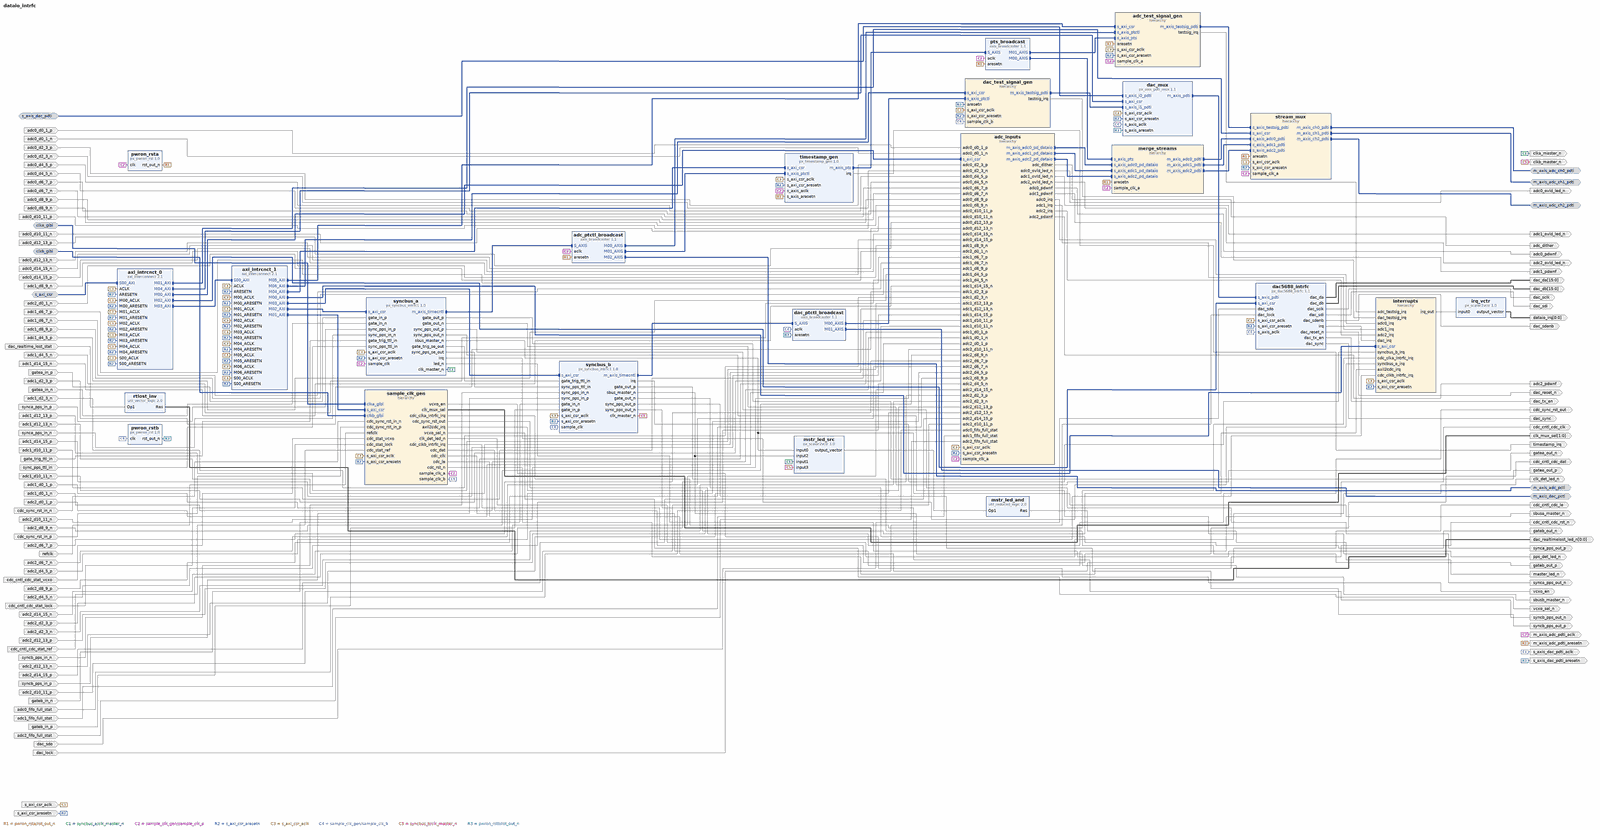
[diagram p0: block diagram of the top level, whole]
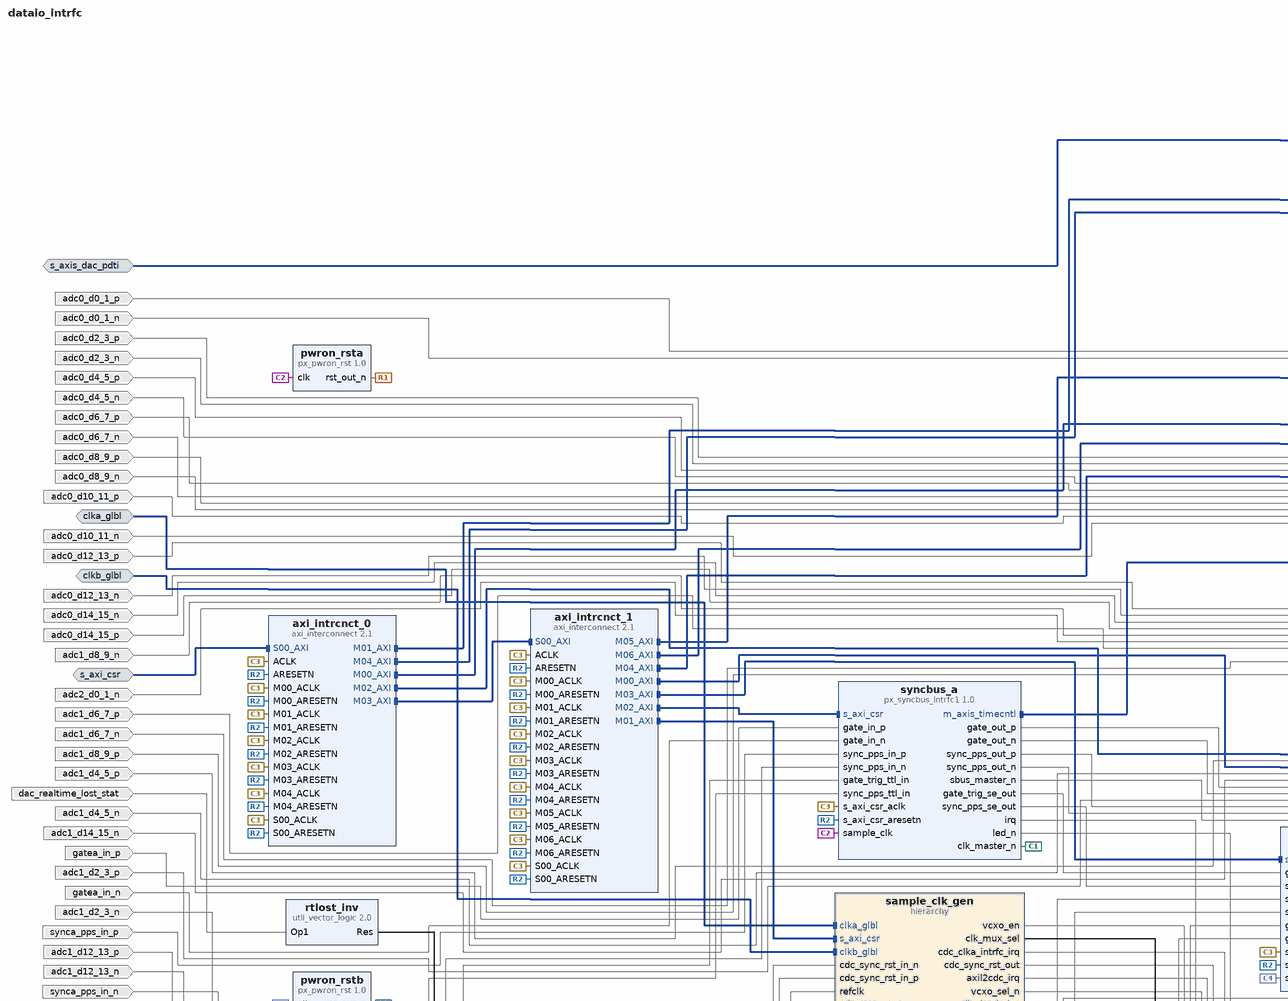
[diagram p1: block diagram of the top level, upper left part]
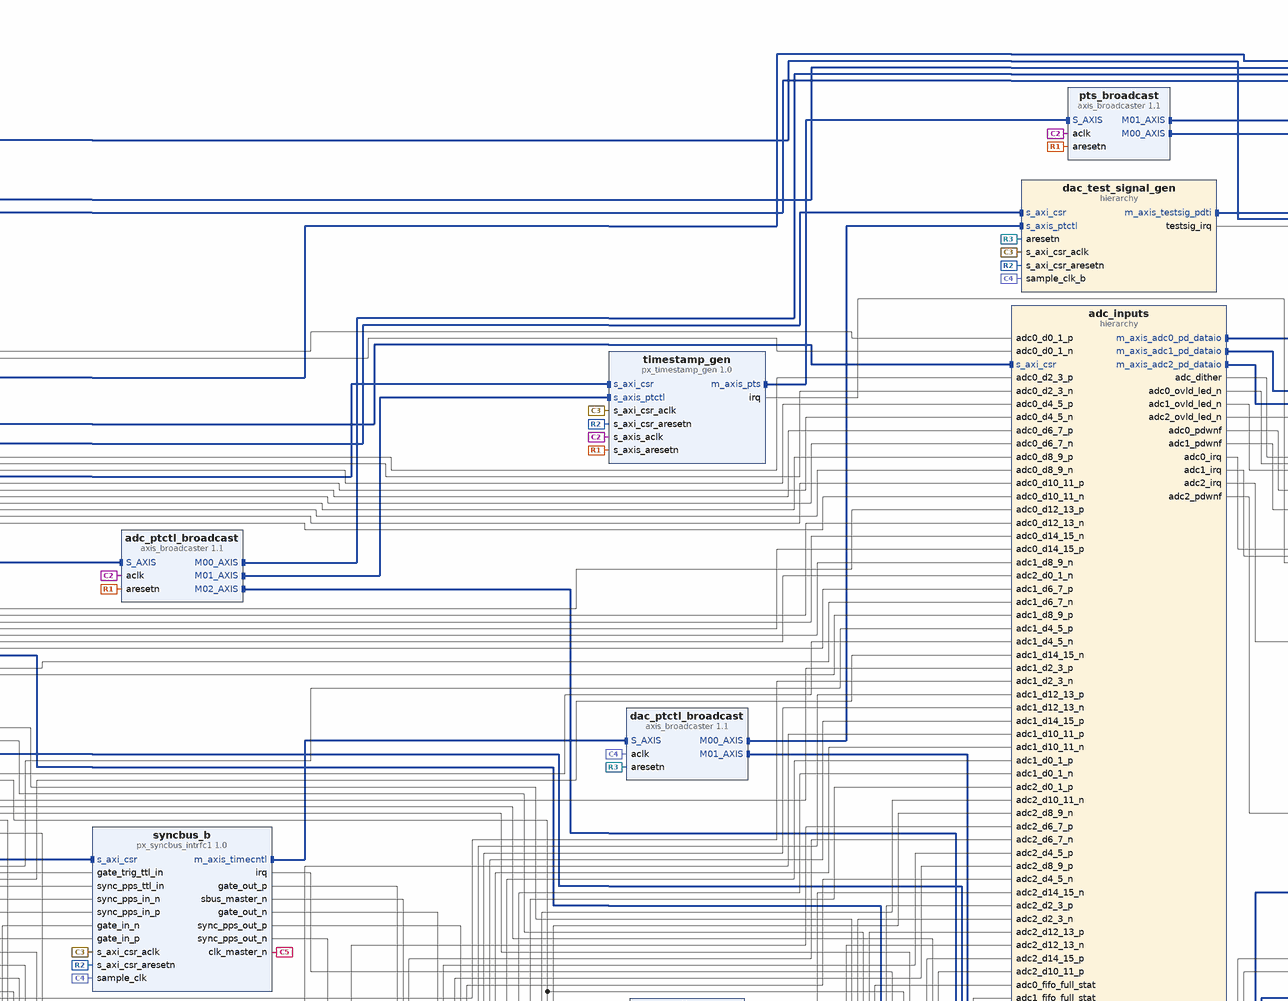
[diagram p2: block diagram of the top level, upper centre part]
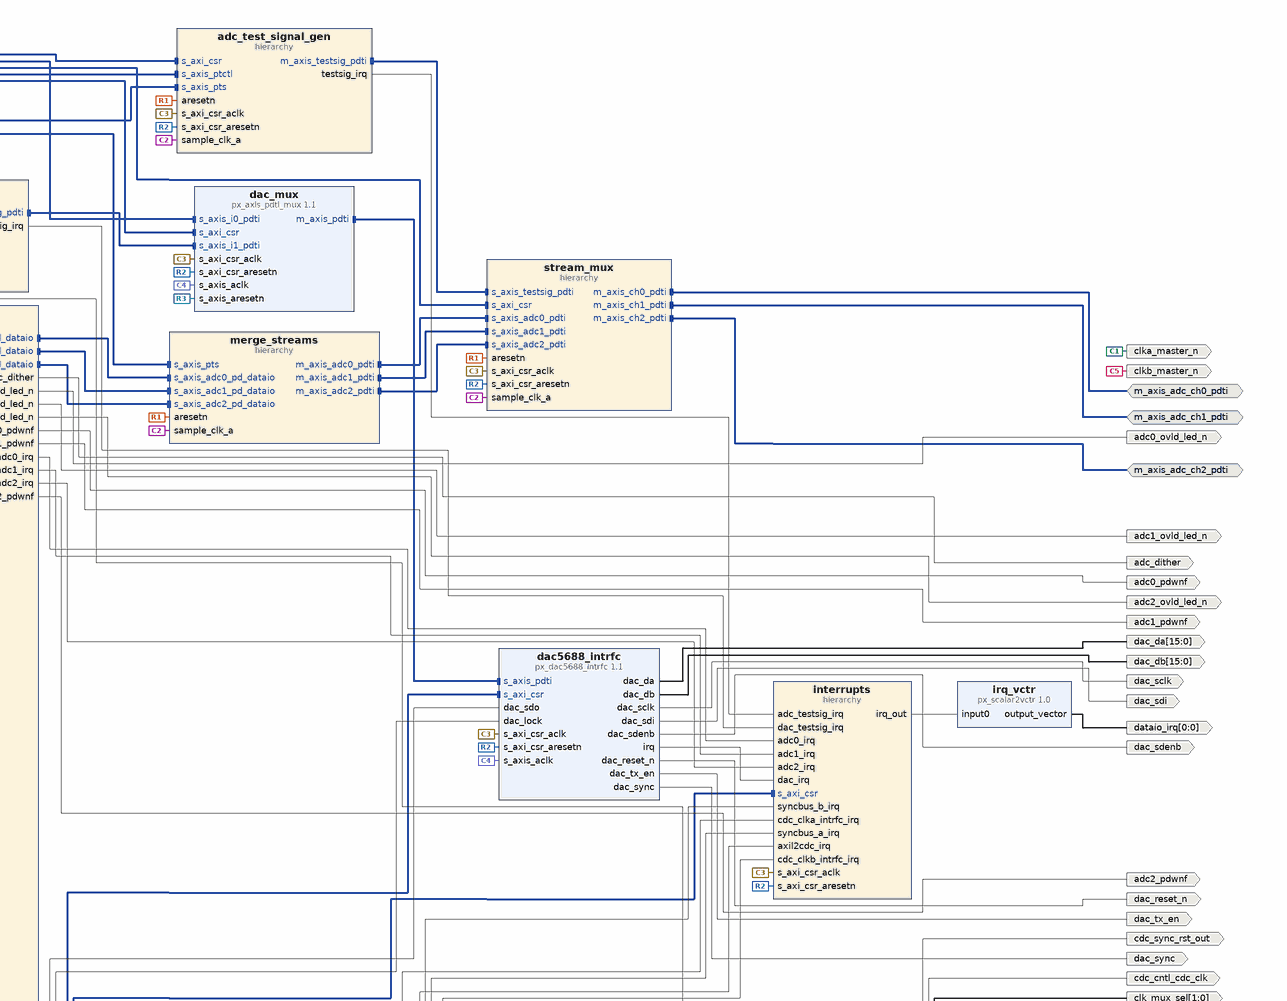
[diagram p3: block diagram of the top level, upper right part]
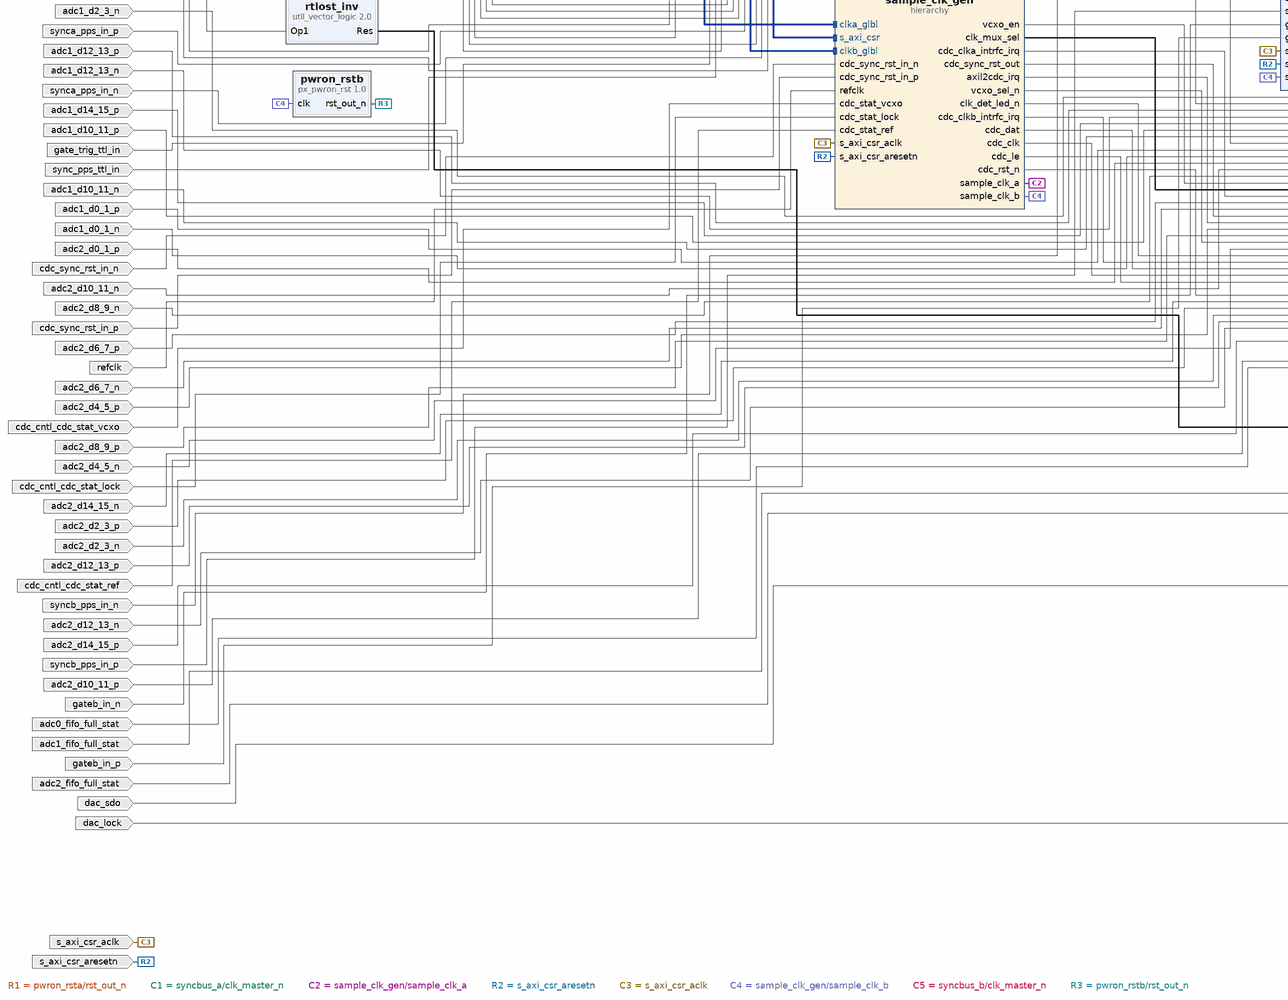
[diagram p4: block diagram of the top level, lower left part]
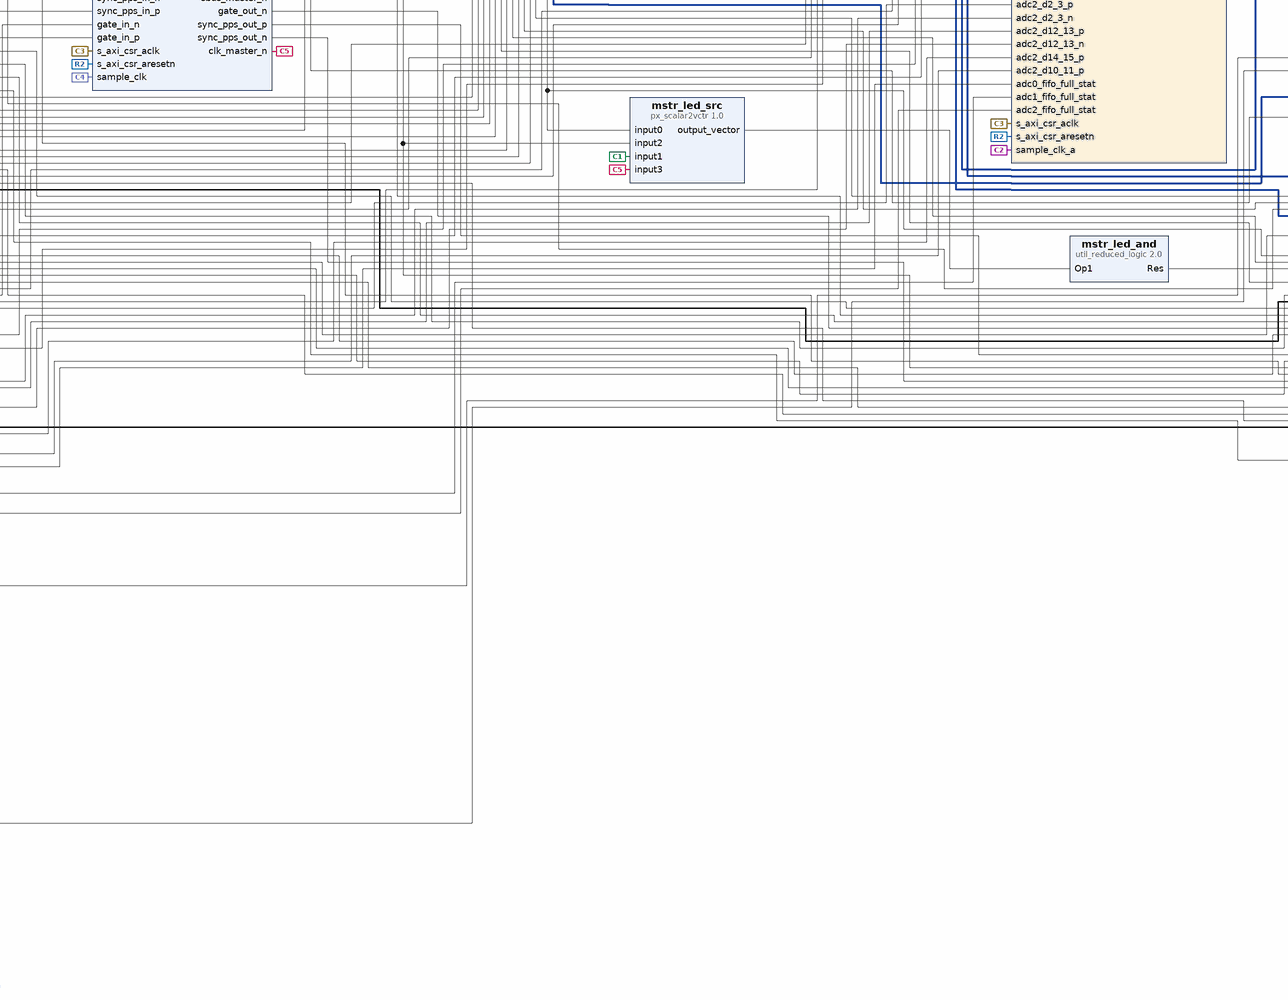
[diagram p5: block diagram of the top level, lower centre part]
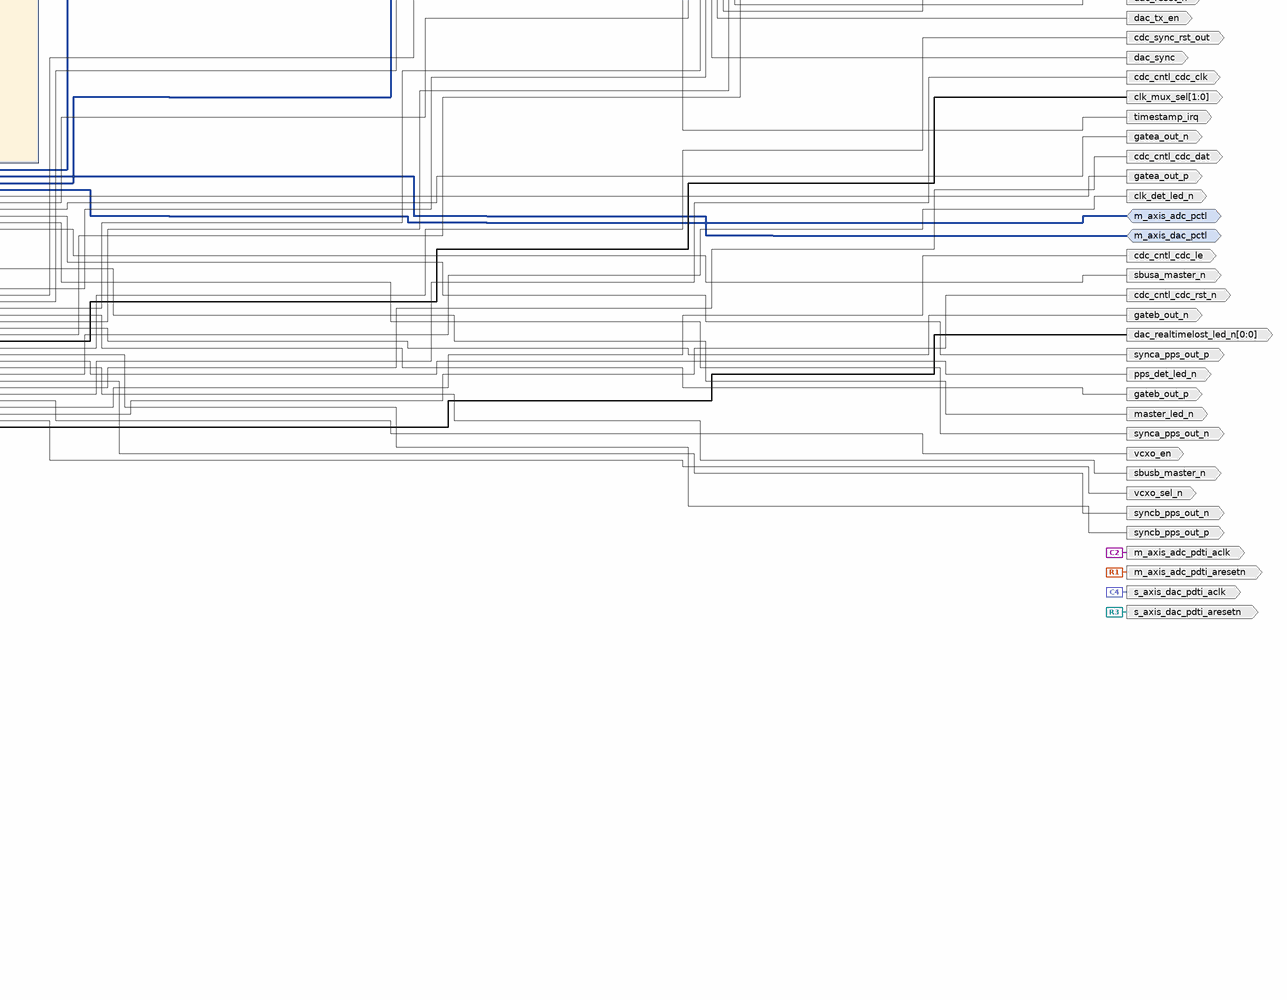
[diagram p6: block diagram of the top level, lower right part]
# Vivado block design dataio_intrfc, xcku060-ffva1156-2-e, Vivado 2017.2
create_bd_design dataio_intrfc

create_bd_intf_port -mode Master -vlnv xilinx.com:interface:axis_rtl:1.0 m_axis_adc_ch0_pdti
create_bd_intf_port -mode Master -vlnv xilinx.com:interface:axis_rtl:1.0 m_axis_adc_ch1_pdti
create_bd_intf_port -mode Master -vlnv xilinx.com:interface:axis_rtl:1.0 m_axis_adc_ch2_pdti
create_bd_intf_port -mode Slave -vlnv xilinx.com:interface:aximm_rtl:1.0 s_axi_csr
set_property -dict [list \
  CONFIG.DATA_WIDTH 32 \
  CONFIG.PROTOCOL AXI4LITE \
  CONFIG.ID_WIDTH 0 \
  CONFIG.ADDR_WIDTH 26 \
  CONFIG.AWUSER_WIDTH 0 \
  CONFIG.ARUSER_WIDTH 0 \
  CONFIG.WUSER_WIDTH 0 \
  CONFIG.RUSER_WIDTH 0 \
  CONFIG.BUSER_WIDTH 0 \
  CONFIG.READ_WRITE_MODE READ_WRITE \
  CONFIG.HAS_BURST 1 \
  CONFIG.HAS_LOCK 1 \
  CONFIG.HAS_PROT 1 \
  CONFIG.HAS_CACHE 1 \
  CONFIG.HAS_QOS 1 \
  CONFIG.HAS_REGION 1 \
  CONFIG.HAS_WSTRB 1 \
  CONFIG.HAS_BRESP 1 \
  CONFIG.HAS_RRESP 1 \
  CONFIG.SUPPORTS_NARROW_BURST 0 \
  CONFIG.NUM_READ_OUTSTANDING 1 \
  CONFIG.NUM_WRITE_OUTSTANDING 1 \
  CONFIG.MAX_BURST_LENGTH 1 \
  CONFIG.NUM_READ_THREADS 1 \
  CONFIG.NUM_WRITE_THREADS 1 \
  CONFIG.RUSER_BITS_PER_BYTE 0 \
  CONFIG.WUSER_BITS_PER_BYTE 0 \
] [get_bd_intf_ports s_axi_csr]
create_bd_intf_port -mode Slave -vlnv xilinx.com:interface:axis_rtl:1.0 s_axis_dac_pdti
set_property -dict [list \
  CONFIG.TDATA_NUM_BYTES 4 \
  CONFIG.TDEST_WIDTH 0 \
  CONFIG.TID_WIDTH 0 \
  CONFIG.TUSER_WIDTH 128 \
  CONFIG.HAS_TREADY 0 \
  CONFIG.HAS_TSTRB 0 \
  CONFIG.HAS_TKEEP 0 \
  CONFIG.HAS_TLAST 0 \
  CONFIG.LAYERED_METADATA undef \
] [get_bd_intf_ports s_axis_dac_pdti]
create_bd_intf_port -mode Master -vlnv xilinx.com:interface:axis_rtl:1.0 m_axis_dac_pctl
create_bd_intf_port -mode Slave -vlnv xilinx.com:interface:diff_clock_rtl:1.0 clka_glbl
set_property -dict {CONFIG.FREQ_HZ 200000000} [get_bd_intf_ports clka_glbl]
create_bd_intf_port -mode Slave -vlnv xilinx.com:interface:diff_clock_rtl:1.0 clkb_glbl
set_property -dict {CONFIG.FREQ_HZ 250000000} [get_bd_intf_ports clkb_glbl]
create_bd_intf_port -mode Master -vlnv xilinx.com:interface:axis_rtl:1.0 m_axis_adc_pctl
create_bd_port -dir I adc0_d0_1_p
create_bd_port -dir I adc0_d0_1_n
create_bd_port -dir I adc0_d2_3_p
create_bd_port -dir I adc0_d2_3_n
create_bd_port -dir I adc0_d4_5_p
create_bd_port -dir I adc0_d4_5_n
create_bd_port -dir I adc0_d6_7_p
create_bd_port -dir I adc0_d6_7_n
create_bd_port -dir I adc0_d8_9_p
create_bd_port -dir I adc0_d8_9_n
create_bd_port -dir I adc0_d10_11_p
create_bd_port -dir I adc0_d10_11_n
create_bd_port -dir I adc0_d12_13_p
create_bd_port -dir I adc0_d12_13_n
create_bd_port -dir I adc0_d14_15_n
create_bd_port -dir I adc0_d14_15_p
create_bd_port -dir I adc1_d8_9_n
create_bd_port -dir I adc2_d0_1_n
create_bd_port -dir I adc1_d6_7_p
create_bd_port -dir I adc1_d6_7_n
create_bd_port -dir I adc1_d8_9_p
create_bd_port -dir I adc1_d4_5_p
create_bd_port -dir I adc1_d4_5_n
create_bd_port -dir I adc1_d14_15_n
create_bd_port -dir I adc1_d2_3_p
create_bd_port -dir I adc1_d2_3_n
create_bd_port -dir I adc1_d12_13_p
create_bd_port -dir I adc1_d12_13_n
create_bd_port -dir I adc1_d14_15_p
create_bd_port -dir I adc1_d10_11_p
create_bd_port -dir I adc1_d10_11_n
create_bd_port -dir I adc1_d0_1_p
create_bd_port -dir I adc1_d0_1_n
create_bd_port -dir I adc2_d0_1_p
create_bd_port -dir I adc2_d10_11_n
create_bd_port -dir I adc2_d8_9_n
create_bd_port -dir I adc2_d6_7_p
create_bd_port -dir I adc2_d6_7_n
create_bd_port -dir I adc2_d4_5_p
create_bd_port -dir I adc2_d8_9_p
create_bd_port -dir I adc2_d4_5_n
create_bd_port -dir I adc2_d14_15_n
create_bd_port -dir I adc2_d2_3_p
create_bd_port -dir I adc2_d2_3_n
create_bd_port -dir I adc2_d12_13_p
create_bd_port -dir I adc2_d12_13_n
create_bd_port -dir I adc2_d14_15_p
create_bd_port -dir I adc2_d10_11_p
create_bd_port -dir O -type rst m_axis_adc_pdti_aresetn
create_bd_port -dir I gatea_in_p
create_bd_port -dir I gatea_in_n
create_bd_port -dir I synca_pps_in_p
create_bd_port -dir I synca_pps_in_n
create_bd_port -dir I gate_trig_ttl_in
create_bd_port -dir I sync_pps_ttl_in
create_bd_port -dir O gatea_out_p
create_bd_port -dir O gatea_out_n
create_bd_port -dir O synca_pps_out_p
create_bd_port -dir O synca_pps_out_n
create_bd_port -dir O sbusa_master_n
create_bd_port -dir O clka_master_n
create_bd_port -dir O pps_det_led_n
create_bd_port -dir O vcxo_en
create_bd_port -dir O vcxo_sel_n
create_bd_port -dir O -from 1 -to 0 clk_mux_sel
create_bd_port -dir O cdc_sync_rst_out
create_bd_port -dir O clk_det_led_n
create_bd_port -dir I cdc_sync_rst_in_n
create_bd_port -dir I cdc_sync_rst_in_p
create_bd_port -dir O -type clk m_axis_adc_pdti_aclk
set_property -dict [list \
  CONFIG.ASSOCIATED_BUSIF m_axis_adc_ch1_pdti:m_axis_adc_ch0_pdti:m_axis_adc_ch2_pdti:m_axis_adc_pctl \
  CONFIG.ASSOCIATED_RESET m_axis_adc_pdti_aresetn \
] [get_bd_ports m_axis_adc_pdti_aclk]
create_bd_port -dir I adc0_fifo_full_stat
create_bd_port -dir I adc1_fifo_full_stat
create_bd_port -dir I adc2_fifo_full_stat
create_bd_port -dir I dac_realtime_lost_stat
create_bd_port -dir O adc_dither
create_bd_port -dir O adc0_ovld_led_n
create_bd_port -dir O adc1_ovld_led_n
create_bd_port -dir O adc2_ovld_led_n
create_bd_port -dir O adc0_pdwnf
create_bd_port -dir O adc1_pdwnf
create_bd_port -dir O adc2_pdwnf
create_bd_port -dir I -type rst s_axi_csr_aresetn
create_bd_port -dir I -type clk s_axi_csr_aclk
set_property -dict {CONFIG.FREQ_HZ 250000000 CONFIG.ASSOCIATED_RESET s_axi_csr_aresetn} [get_bd_ports s_axi_csr_aclk]
create_bd_port -dir O master_led_n
create_bd_port -dir O -type intr timestamp_irq
create_bd_port -dir I -type clk refclk
set_property -dict {CONFIG.FREQ_HZ 200000000} [get_bd_ports refclk]
create_bd_port -dir O -from 0 -to 0 -type intr dataio_irq
create_bd_port -dir O -from 15 -to 0 dac_da
create_bd_port -dir O -from 15 -to 0 dac_db
create_bd_port -dir O dac_sclk
create_bd_port -dir O dac_sdi
create_bd_port -dir O dac_sdenb
create_bd_port -dir O dac_tx_en
create_bd_port -dir O dac_sync
create_bd_port -dir O dac_reset_n
create_bd_port -dir I dac_sdo
create_bd_port -dir I dac_lock
create_bd_port -dir O -from 0 -to 0 dac_realtimelost_led_n
create_bd_port -dir O -type clk s_axis_dac_pdti_aclk
set_property -dict [list \
  CONFIG.ASSOCIATED_BUSIF s_axis_dac_pdti:m_axis_dac_pctl \
  CONFIG.ASSOCIATED_RESET s_axis_dac_pdti_aresetn \
] [get_bd_ports s_axis_dac_pdti_aclk]
create_bd_port -dir I syncb_pps_in_n
create_bd_port -dir I syncb_pps_in_p
create_bd_port -dir I gateb_in_n
create_bd_port -dir I gateb_in_p
create_bd_port -dir O gateb_out_p
create_bd_port -dir O gateb_out_n
create_bd_port -dir O syncb_pps_out_p
create_bd_port -dir O syncb_pps_out_n
create_bd_port -dir O sbusb_master_n
create_bd_port -dir O clkb_master_n
create_bd_port -dir O -type rst s_axis_dac_pdti_aresetn
create_bd_port -dir I cdc_cntl_cdc_stat_vcxo
create_bd_port -dir I cdc_cntl_cdc_stat_lock
create_bd_port -dir I cdc_cntl_cdc_stat_ref
create_bd_port -dir O cdc_cntl_cdc_dat
create_bd_port -dir O -type clk cdc_cntl_cdc_clk
create_bd_port -dir O cdc_cntl_cdc_le
create_bd_port -dir O -type rst cdc_cntl_cdc_rst_n

create_bd_cell -type hier adc_inputs
create_bd_cell -type hier merge_streams
create_bd_cell -type hier stream_mux
create_bd_cell -type hier adc_test_signal_gen
create_bd_cell -type hier sample_clk_gen
create_bd_cell -type hier interrupts
create_bd_cell -type hier dac_test_signal_gen
create_bd_cell -type ip -vlnv xilinx.com:ip:util_reduced_logic:2.0 mstr_led_and
set_property -dict {CONFIG.C_SIZE 4} [get_bd_cells mstr_led_and]
create_bd_cell -type ip -vlnv xilinx.com:ip:axis_broadcaster:1.1 dac_ptctl_broadcast
create_bd_cell -type ip -vlnv xilinx.com:ip:axi_interconnect:2.1 axi_intrcnct_0
set_property -dict [list \
  CONFIG.NUM_SI 1 \
  CONFIG.NUM_MI 5 \
  CONFIG.M00_HAS_REGSLICE 1 \
  CONFIG.M01_HAS_REGSLICE 1 \
  CONFIG.M02_HAS_REGSLICE 1 \
  CONFIG.M03_HAS_REGSLICE 1 \
  CONFIG.M04_HAS_REGSLICE 1 \
  CONFIG.M05_HAS_REGSLICE 1 \
  CONFIG.M06_HAS_REGSLICE 1 \
  CONFIG.M07_HAS_REGSLICE 1 \
  CONFIG.S00_HAS_REGSLICE 1 \
] [get_bd_cells axi_intrcnct_0]
create_bd_cell -type ip -vlnv xilinx.com:ip:axi_interconnect:2.1 axi_intrcnct_1
set_property -dict [list \
  CONFIG.NUM_SI 1 \
  CONFIG.NUM_MI 7 \
  CONFIG.M00_HAS_REGSLICE 3 \
  CONFIG.M01_HAS_REGSLICE 3 \
  CONFIG.M02_HAS_REGSLICE 3 \
  CONFIG.M03_HAS_REGSLICE 3 \
  CONFIG.M04_HAS_REGSLICE 3 \
  CONFIG.M05_HAS_REGSLICE 3 \
  CONFIG.M06_HAS_REGSLICE 3 \
  CONFIG.M07_HAS_REGSLICE 1 \
  CONFIG.S00_HAS_REGSLICE 1 \
] [get_bd_cells axi_intrcnct_1]
create_bd_cell -type ip -vlnv xilinx.com:ip:axis_broadcaster:1.1 pts_broadcast
set_property -dict [list \
  CONFIG.M00_TDATA_REMAP {tdata[63:0]} \
  CONFIG.M01_TDATA_REMAP {tdata[63:0]} \
  CONFIG.M00_TUSER_REMAP {tuser[23:0]} \
  CONFIG.M01_TUSER_REMAP {tuser[23:0]} \
] [get_bd_cells pts_broadcast]
create_bd_cell -type ip -vlnv xilinx.com:ip:axis_broadcaster:1.1 adc_ptctl_broadcast
set_property -dict {CONFIG.NUM_MI 3 CONFIG.M02_TDATA_REMAP {tdata[7:0]}} [get_bd_cells adc_ptctl_broadcast]
create_bd_cell -type ip -vlnv pentek.com:px_ip:px_pwron_rst:1.0 pwron_rstb
set_property -dict {CONFIG.rst_clk_cycles 32 CONFIG.has_rst_input false CONFIG.has_rst_output false} [get_bd_cells pwron_rstb]
create_bd_cell -type ip -vlnv pentek.com:px_ip:px_axis_pdti_mux:1.1 dac_mux
set_property -dict {CONFIG.data_byte_width 4} [get_bd_cells dac_mux]
create_bd_cell -type ip -vlnv pentek.com:px_ip:px_dac5688_intrfc:1.1 dac5688_intrfc
set_property -dict {CONFIG.initial_tap_delay 175} [get_bd_cells dac5688_intrfc]
create_bd_cell -type ip -vlnv pentek.com:px_ip:px_pwron_rst:1.0 pwron_rsta
set_property -dict {CONFIG.rst_clk_cycles 32 CONFIG.has_rst_input false CONFIG.has_rst_output false} [get_bd_cells pwron_rsta]
create_bd_cell -type ip -vlnv pentek.com:px_ip:px_scalar2vctr:1.0 mstr_led_src
set_property -dict {CONFIG.number_inputs 4} [get_bd_cells mstr_led_src]
create_bd_cell -type ip -vlnv pentek.com:px_ip:px_scalar2vctr:1.0 irq_vctr
set_property -dict {CONFIG.number_inputs 1} [get_bd_cells irq_vctr]
create_bd_cell -type ip -vlnv pentek.com:px_ip:px_timestamp_gen:1.0 timestamp_gen
set_property -dict {CONFIG.pts_signal_width 1 CONFIG.has_des_ctl false} [get_bd_cells timestamp_gen]
create_bd_cell -type ip -vlnv pentek.com:px_ip:px_syncbus_intrfc1:1.0 syncbus_b
set_property -dict [list \
  CONFIG.is_single_ended_sig_master false \
  CONFIG.has_ssmc_gate_input false \
  CONFIG.has_user_pps_input false \
  CONFIG.ibuf_low_pwr true \
  CONFIG.initial_led_src 0 \
  CONFIG.has_user_sync_drive_in false \
  CONFIG.has_user_gate_drive_in false \
] [get_bd_cells syncbus_b]
create_bd_cell -type ip -vlnv xilinx.com:ip:util_vector_logic:2.0 rtlost_inv
set_property -dict {CONFIG.C_SIZE 1 CONFIG.C_OPERATION not} [get_bd_cells rtlost_inv]
create_bd_cell -type ip -vlnv pentek.com:px_ip:px_syncbus_intrfc1:1.0 syncbus_a
set_property -dict [list \
  CONFIG.has_ssmc_gate_input false \
  CONFIG.has_user_pps_input false \
  CONFIG.ibuf_low_pwr true \
  CONFIG.initial_led_src 0 \
  CONFIG.has_user_sync_drive_in false \
  CONFIG.has_user_gate_drive_in false \
  CONFIG.has_gate_trig_se_out true \
  CONFIG.has_sync_pps_se_out true \
] [get_bd_cells syncbus_a]

# ---- hierarchy /adc_inputs ----
current_bd_instance /adc_inputs
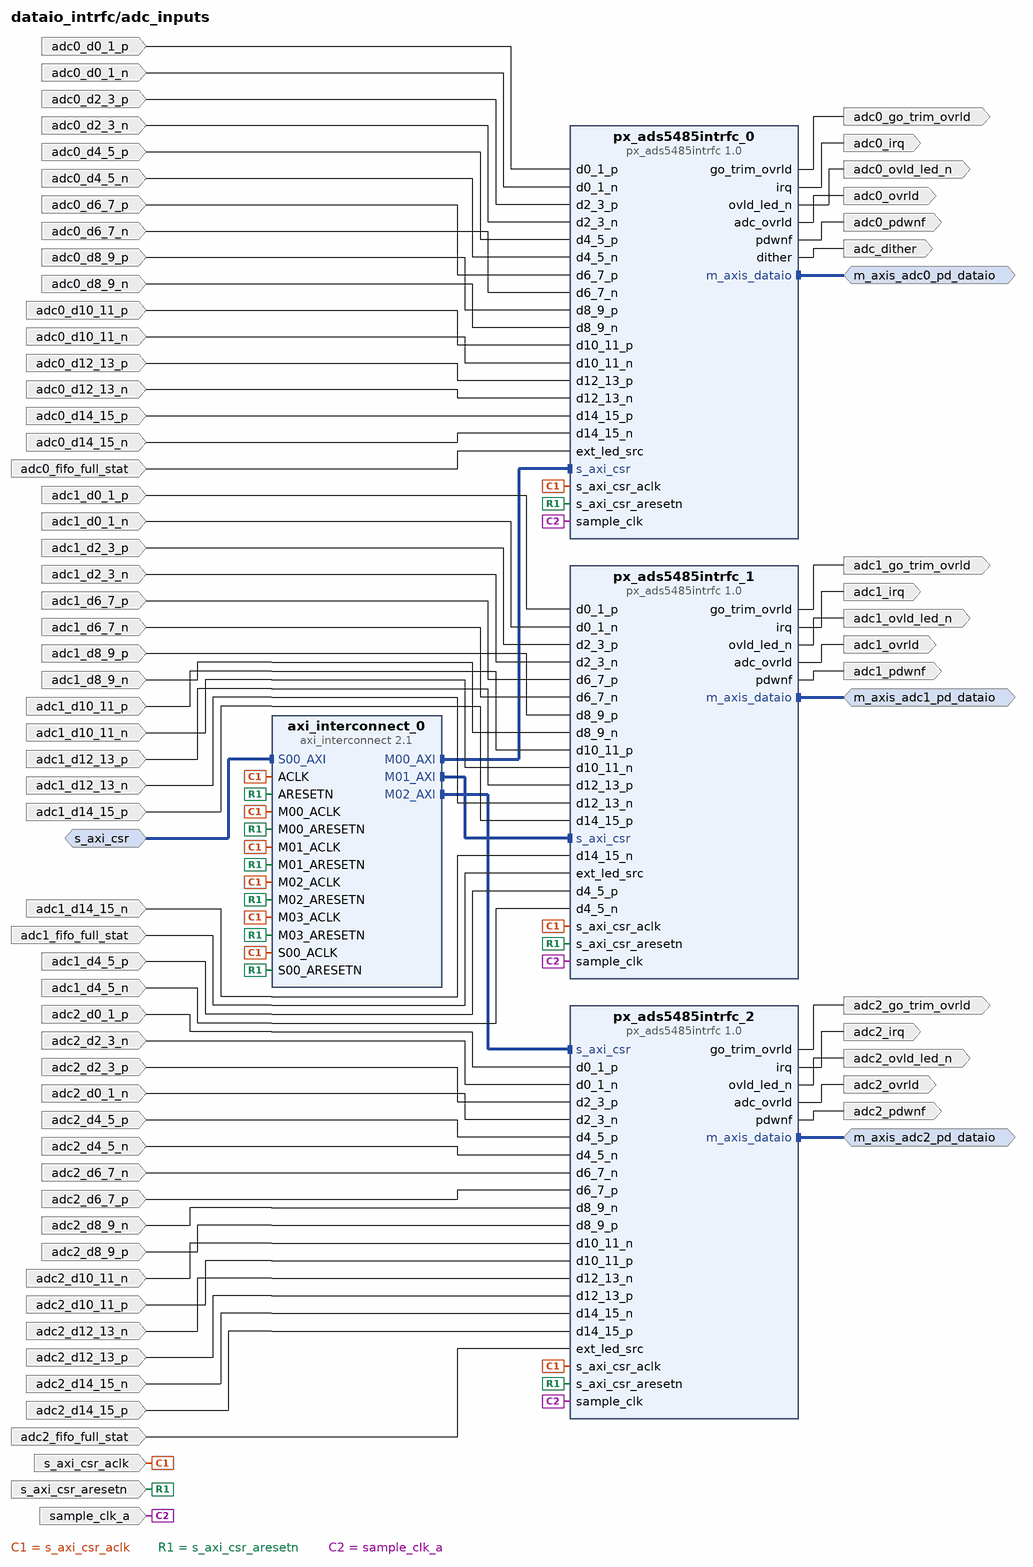
[diagram p7: block diagram inside /adc_inputs]
create_bd_intf_pin -mode Slave -vlnv xilinx.com:interface:aximm_rtl:1.0 s_axi_csr
create_bd_intf_pin -mode Master -vlnv xilinx.com:interface:axis_rtl:1.0 m_axis_adc0_pd_dataio
create_bd_intf_pin -mode Master -vlnv xilinx.com:interface:axis_rtl:1.0 m_axis_adc1_pd_dataio
create_bd_intf_pin -mode Master -vlnv xilinx.com:interface:axis_rtl:1.0 m_axis_adc2_pd_dataio
create_bd_pin -dir I s_axi_csr_aclk
create_bd_pin -dir I s_axi_csr_aresetn
create_bd_pin -dir I adc0_d0_1_p
create_bd_pin -dir I adc0_d0_1_n
create_bd_pin -dir I adc0_d2_3_p
create_bd_pin -dir I adc0_d2_3_n
create_bd_pin -dir I adc0_d4_5_p
create_bd_pin -dir I adc0_d4_5_n
create_bd_pin -dir I adc0_d6_7_p
create_bd_pin -dir I adc0_d6_7_n
create_bd_pin -dir I adc0_d8_9_p
create_bd_pin -dir I adc0_d8_9_n
create_bd_pin -dir I adc0_d10_11_p
create_bd_pin -dir I adc0_d10_11_n
create_bd_pin -dir I adc0_d12_13_p
create_bd_pin -dir I adc0_d12_13_n
create_bd_pin -dir I adc0_d14_15_n
create_bd_pin -dir I adc0_d14_15_p
create_bd_pin -dir I sample_clk_a
create_bd_pin -dir I adc1_d0_1_n
create_bd_pin -dir I adc1_d0_1_p
create_bd_pin -dir I adc1_d10_11_n
create_bd_pin -dir I adc1_d10_11_p
create_bd_pin -dir I adc1_d12_13_n
create_bd_pin -dir I adc1_d12_13_p
create_bd_pin -dir I adc1_d14_15_n
create_bd_pin -dir I adc1_d14_15_p
create_bd_pin -dir I adc1_d2_3_n
create_bd_pin -dir I adc1_d2_3_p
create_bd_pin -dir I adc1_d4_5_n
create_bd_pin -dir I adc1_d4_5_p
create_bd_pin -dir I adc1_d6_7_n
create_bd_pin -dir I adc1_d6_7_p
create_bd_pin -dir I adc1_d8_9_n
create_bd_pin -dir I adc1_d8_9_p
create_bd_pin -dir I adc2_d0_1_n
create_bd_pin -dir I adc2_d0_1_p
create_bd_pin -dir I adc2_d10_11_n
create_bd_pin -dir I adc2_d10_11_p
create_bd_pin -dir I adc2_d12_13_n
create_bd_pin -dir I adc2_d12_13_p
create_bd_pin -dir I adc2_d14_15_n
create_bd_pin -dir I adc2_d14_15_p
create_bd_pin -dir I adc2_d2_3_n
create_bd_pin -dir I adc2_d2_3_p
create_bd_pin -dir I adc2_d4_5_n
create_bd_pin -dir I adc2_d4_5_p
create_bd_pin -dir I adc2_d6_7_n
create_bd_pin -dir I adc2_d6_7_p
create_bd_pin -dir I adc2_d8_9_n
create_bd_pin -dir I adc2_d8_9_p
create_bd_pin -dir I adc0_fifo_full_stat
create_bd_pin -dir I adc1_fifo_full_stat
create_bd_pin -dir I adc2_fifo_full_stat
create_bd_pin -dir O adc0_irq
create_bd_pin -dir O adc0_pdwnf
create_bd_pin -dir O adc_dither
create_bd_pin -dir O adc0_ovld_led_n
create_bd_pin -dir O adc1_ovld_led_n
create_bd_pin -dir O adc2_ovld_led_n
create_bd_pin -dir O adc0_ovrld
create_bd_pin -dir O adc1_ovrld
create_bd_pin -dir O adc2_ovrld
create_bd_pin -dir O adc0_go_trim_ovrld
create_bd_pin -dir O adc1_go_trim_ovrld
create_bd_pin -dir O adc2_go_trim_ovrld
create_bd_pin -dir O adc1_irq
create_bd_pin -dir O adc2_irq
create_bd_pin -dir O adc1_pdwnf
create_bd_pin -dir O adc2_pdwnf

create_bd_cell -type ip -vlnv xilinx.com:ip:axi_interconnect:2.1 axi_interconnect_0
set_property -dict [list \
  CONFIG.NUM_MI 4 \
  CONFIG.M00_HAS_REGSLICE 3 \
  CONFIG.M01_HAS_REGSLICE 3 \
  CONFIG.M02_HAS_REGSLICE 3 \
  CONFIG.M03_HAS_REGSLICE 3 \
  CONFIG.S00_HAS_REGSLICE 1 \
] [get_bd_cells axi_interconnect_0]
create_bd_cell -type ip -vlnv pentek.com:px_ip:px_ads5485intrfc:1.0 px_ads5485intrfc_0
set_property -dict {CONFIG.initial_tap_delay 230} [get_bd_cells px_ads5485intrfc_0]
create_bd_cell -type ip -vlnv pentek.com:px_ip:px_ads5485intrfc:1.0 px_ads5485intrfc_1
set_property -dict {CONFIG.initial_tap_delay 230} [get_bd_cells px_ads5485intrfc_1]
create_bd_cell -type ip -vlnv pentek.com:px_ip:px_ads5485intrfc:1.0 px_ads5485intrfc_2
set_property -dict {CONFIG.initial_tap_delay 230} [get_bd_cells px_ads5485intrfc_2]

# ---- hierarchy /merge_streams ----
current_bd_instance /merge_streams
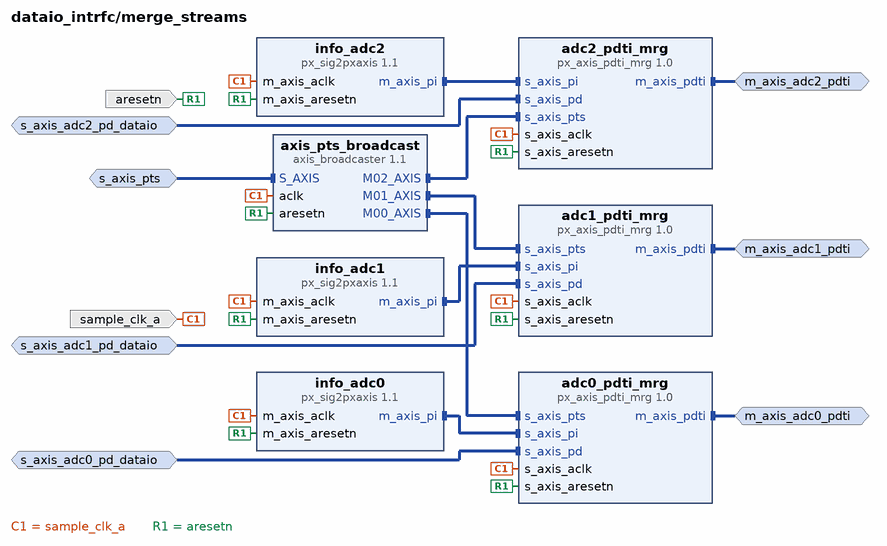
[diagram p8: block diagram inside /merge_streams]
create_bd_intf_pin -mode Slave -vlnv xilinx.com:interface:axis_rtl:1.0 s_axis_pts
create_bd_intf_pin -mode Master -vlnv xilinx.com:interface:axis_rtl:1.0 m_axis_adc0_pdti
create_bd_intf_pin -mode Master -vlnv xilinx.com:interface:axis_rtl:1.0 m_axis_adc1_pdti
create_bd_intf_pin -mode Master -vlnv xilinx.com:interface:axis_rtl:1.0 m_axis_adc2_pdti
create_bd_intf_pin -mode Slave -vlnv xilinx.com:interface:axis_rtl:1.0 s_axis_adc0_pd_dataio
create_bd_intf_pin -mode Slave -vlnv xilinx.com:interface:axis_rtl:1.0 s_axis_adc1_pd_dataio
create_bd_intf_pin -mode Slave -vlnv xilinx.com:interface:axis_rtl:1.0 s_axis_adc2_pd_dataio
create_bd_pin -dir I sample_clk_a
create_bd_pin -dir I aresetn

create_bd_cell -type ip -vlnv xilinx.com:ip:axis_broadcaster:1.1 axis_pts_broadcast
set_property -dict [list \
  CONFIG.NUM_MI 4 \
  CONFIG.M00_TDATA_REMAP {tdata[63:0]} \
  CONFIG.M01_TDATA_REMAP {tdata[63:0]} \
  CONFIG.M02_TDATA_REMAP {tdata[63:0]} \
  CONFIG.M03_TDATA_REMAP {tdata[63:0]} \
  CONFIG.M04_TDATA_REMAP {tdata[7:0]} \
  CONFIG.M00_TUSER_REMAP {tuser[23:0]} \
  CONFIG.M01_TUSER_REMAP {tuser[23:0]} \
  CONFIG.M02_TUSER_REMAP {tuser[23:0]} \
  CONFIG.M03_TUSER_REMAP {tuser[23:0]} \
] [get_bd_cells axis_pts_broadcast]
create_bd_cell -type ip -vlnv pentek.com:px_ip:px_axis_pdti_mrg:1.0 adc0_pdti_mrg
set_property -dict {CONFIG.data_stream_delay 0 CONFIG.info_stream_delay 0 CONFIG.time_stream_delay 1} [get_bd_cells adc0_pdti_mrg]
create_bd_cell -type ip -vlnv pentek.com:px_ip:px_axis_pdti_mrg:1.0 adc1_pdti_mrg
set_property -dict {CONFIG.data_stream_delay 0 CONFIG.info_stream_delay 0 CONFIG.time_stream_delay 1} [get_bd_cells adc1_pdti_mrg]
create_bd_cell -type ip -vlnv pentek.com:px_ip:px_axis_pdti_mrg:1.0 adc2_pdti_mrg
set_property -dict {CONFIG.data_stream_delay 0 CONFIG.info_stream_delay 0 CONFIG.time_stream_delay 1} [get_bd_cells adc2_pdti_mrg]
create_bd_cell -type ip -vlnv pentek.com:px_ip:px_sig2pxaxis:1.1 info_adc0
set_property -dict [list \
  CONFIG.has_pd_output false \
  CONFIG.has_pts_output false \
  CONFIG.use_info_inputs false \
  CONFIG.use_input_tvalid false \
  CONFIG.has_ptctl_output false \
] [get_bd_cells info_adc0]
create_bd_cell -type ip -vlnv pentek.com:px_ip:px_sig2pxaxis:1.1 info_adc1
set_property -dict [list \
  CONFIG.has_pd_output false \
  CONFIG.has_pts_output false \
  CONFIG.use_info_inputs false \
  CONFIG.use_input_tvalid false \
  CONFIG.dflt_channel 1 \
  CONFIG.has_ptctl_output false \
] [get_bd_cells info_adc1]
create_bd_cell -type ip -vlnv pentek.com:px_ip:px_sig2pxaxis:1.1 info_adc2
set_property -dict [list \
  CONFIG.has_pd_output false \
  CONFIG.has_pts_output false \
  CONFIG.use_info_inputs false \
  CONFIG.use_input_tvalid false \
  CONFIG.dflt_channel 2 \
  CONFIG.has_ptctl_output false \
] [get_bd_cells info_adc2]

# ---- hierarchy /stream_mux ----
current_bd_instance /stream_mux
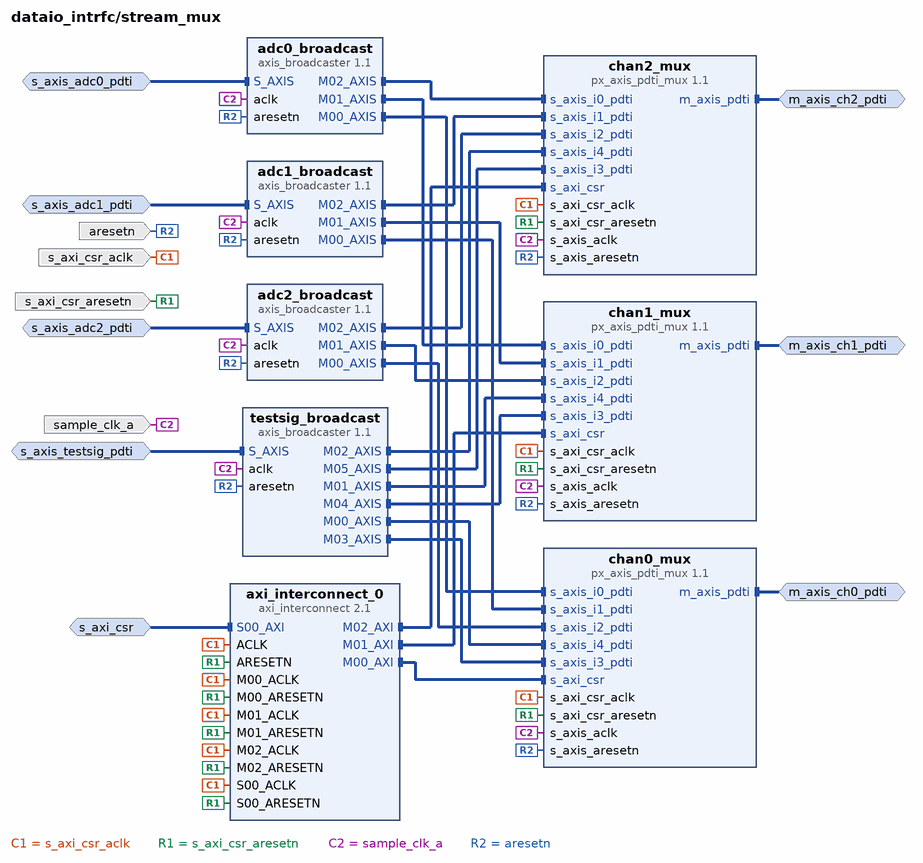
[diagram p9: block diagram inside /stream_mux]
create_bd_intf_pin -mode Slave -vlnv xilinx.com:interface:aximm_rtl:1.0 s_axi_csr
create_bd_intf_pin -mode Slave -vlnv xilinx.com:interface:axis_rtl:1.0 s_axis_adc0_pdti
create_bd_intf_pin -mode Slave -vlnv xilinx.com:interface:axis_rtl:1.0 s_axis_adc1_pdti
create_bd_intf_pin -mode Slave -vlnv xilinx.com:interface:axis_rtl:1.0 s_axis_adc2_pdti
create_bd_intf_pin -mode Slave -vlnv xilinx.com:interface:axis_rtl:1.0 s_axis_testsig_pdti
create_bd_intf_pin -mode Master -vlnv xilinx.com:interface:axis_rtl:1.0 m_axis_ch0_pdti
create_bd_intf_pin -mode Master -vlnv xilinx.com:interface:axis_rtl:1.0 m_axis_ch1_pdti
create_bd_intf_pin -mode Master -vlnv xilinx.com:interface:axis_rtl:1.0 m_axis_ch2_pdti
create_bd_pin -dir I s_axi_csr_aclk
create_bd_pin -dir I s_axi_csr_aresetn
create_bd_pin -dir I sample_clk_a
create_bd_pin -dir I aresetn

create_bd_cell -type ip -vlnv xilinx.com:ip:axi_interconnect:2.1 axi_interconnect_0
set_property -dict [list \
  CONFIG.NUM_MI 3 \
  CONFIG.M00_HAS_REGSLICE 3 \
  CONFIG.M01_HAS_REGSLICE 3 \
  CONFIG.M02_HAS_REGSLICE 3 \
  CONFIG.M03_HAS_REGSLICE 3 \
  CONFIG.S00_HAS_REGSLICE 1 \
] [get_bd_cells axi_interconnect_0]
create_bd_cell -type ip -vlnv xilinx.com:ip:axis_broadcaster:1.1 adc0_broadcast
set_property -dict [list \
  CONFIG.NUM_MI 3 \
  CONFIG.M_TDATA_NUM_BYTES 2 \
  CONFIG.S_TDATA_NUM_BYTES 2 \
  CONFIG.M_TUSER_WIDTH 128 \
  CONFIG.S_TUSER_WIDTH 128 \
  CONFIG.HAS_TREADY 0 \
  CONFIG.M00_TDATA_REMAP {tdata[15:0]} \
  CONFIG.M01_TDATA_REMAP {tdata[15:0]} \
  CONFIG.M02_TDATA_REMAP {tdata[15:0]} \
  CONFIG.M03_TDATA_REMAP {tdata[15:0]} \
  CONFIG.M00_TUSER_REMAP {tuser[127:0]} \
  CONFIG.M01_TUSER_REMAP {tuser[127:0]} \
  CONFIG.M02_TUSER_REMAP {tuser[127:0]} \
  CONFIG.M03_TUSER_REMAP {tuser[127:0]} \
] [get_bd_cells adc0_broadcast]
create_bd_cell -type ip -vlnv xilinx.com:ip:axis_broadcaster:1.1 adc1_broadcast
set_property -dict [list \
  CONFIG.NUM_MI 3 \
  CONFIG.M_TDATA_NUM_BYTES 2 \
  CONFIG.S_TDATA_NUM_BYTES 2 \
  CONFIG.M_TUSER_WIDTH 128 \
  CONFIG.S_TUSER_WIDTH 128 \
  CONFIG.HAS_TREADY 0 \
  CONFIG.M00_TDATA_REMAP {tdata[15:0]} \
  CONFIG.M01_TDATA_REMAP {tdata[15:0]} \
  CONFIG.M02_TDATA_REMAP {tdata[15:0]} \
  CONFIG.M03_TDATA_REMAP {tdata[15:0]} \
  CONFIG.M00_TUSER_REMAP {tuser[127:0]} \
  CONFIG.M01_TUSER_REMAP {tuser[127:0]} \
  CONFIG.M02_TUSER_REMAP {tuser[127:0]} \
  CONFIG.M03_TUSER_REMAP {tuser[127:0]} \
] [get_bd_cells adc1_broadcast]
create_bd_cell -type ip -vlnv xilinx.com:ip:axis_broadcaster:1.1 adc2_broadcast
set_property -dict [list \
  CONFIG.NUM_MI 3 \
  CONFIG.M_TDATA_NUM_BYTES 2 \
  CONFIG.S_TDATA_NUM_BYTES 2 \
  CONFIG.M_TUSER_WIDTH 128 \
  CONFIG.S_TUSER_WIDTH 128 \
  CONFIG.HAS_TREADY 0 \
  CONFIG.M00_TDATA_REMAP {tdata[15:0]} \
  CONFIG.M01_TDATA_REMAP {tdata[15:0]} \
  CONFIG.M02_TDATA_REMAP {tdata[15:0]} \
  CONFIG.M03_TDATA_REMAP {tdata[15:0]} \
  CONFIG.M00_TUSER_REMAP {tuser[127:0]} \
  CONFIG.M01_TUSER_REMAP {tuser[127:0]} \
  CONFIG.M02_TUSER_REMAP {tuser[127:0]} \
  CONFIG.M03_TUSER_REMAP {tuser[127:0]} \
] [get_bd_cells adc2_broadcast]
create_bd_cell -type ip -vlnv xilinx.com:ip:axis_broadcaster:1.1 testsig_broadcast
set_property -dict [list \
  CONFIG.NUM_MI 6 \
  CONFIG.M_TDATA_NUM_BYTES 2 \
  CONFIG.S_TDATA_NUM_BYTES 2 \
  CONFIG.M_TUSER_WIDTH 128 \
  CONFIG.S_TUSER_WIDTH 128 \
  CONFIG.HAS_TREADY 0 \
  CONFIG.M00_TDATA_REMAP {tdata[15:0]} \
  CONFIG.M01_TDATA_REMAP {tdata[15:0]} \
  CONFIG.M02_TDATA_REMAP {tdata[15:0]} \
  CONFIG.M03_TDATA_REMAP {tdata[15:0]} \
  CONFIG.M04_TDATA_REMAP {tdata[15:0]} \
  CONFIG.M05_TDATA_REMAP {tdata[15:0]} \
  CONFIG.M00_TUSER_REMAP {tuser[127:0]} \
  CONFIG.M01_TUSER_REMAP {tuser[127:0]} \
  CONFIG.M02_TUSER_REMAP {tuser[127:0]} \
  CONFIG.M03_TUSER_REMAP {tuser[127:0]} \
  CONFIG.M04_TUSER_REMAP {tuser[127:0]} \
  CONFIG.M05_TUSER_REMAP {tuser[127:0]} \
] [get_bd_cells testsig_broadcast]
create_bd_cell -type ip -vlnv pentek.com:px_ip:px_axis_pdti_mux:1.1 chan1_mux
set_property -dict {CONFIG.num_input_streams 5} [get_bd_cells chan1_mux]
create_bd_cell -type ip -vlnv pentek.com:px_ip:px_axis_pdti_mux:1.1 chan2_mux
set_property -dict {CONFIG.num_input_streams 5} [get_bd_cells chan2_mux]
create_bd_cell -type ip -vlnv pentek.com:px_ip:px_axis_pdti_mux:1.1 chan0_mux
set_property -dict {CONFIG.num_input_streams 5} [get_bd_cells chan0_mux]

# ---- hierarchy /adc_test_signal_gen ----
current_bd_instance /adc_test_signal_gen
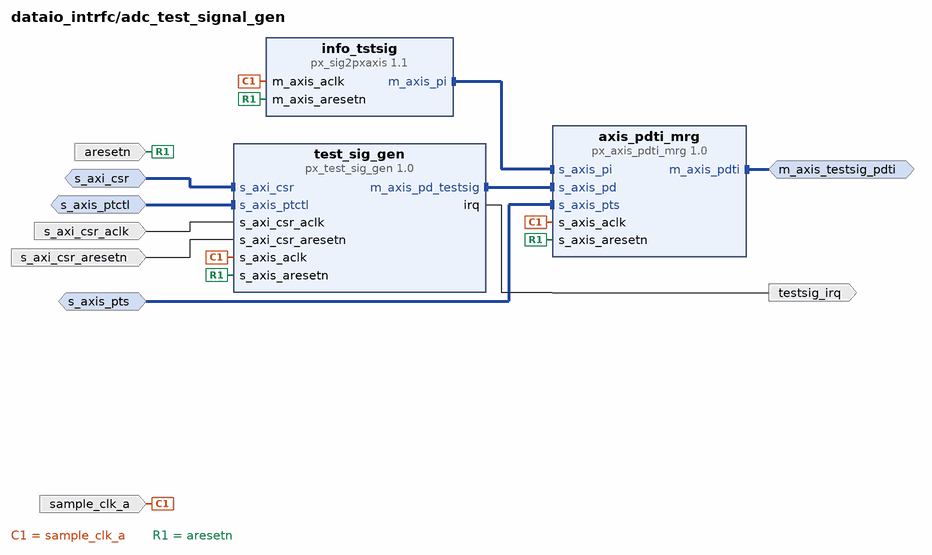
[diagram p10: block diagram inside /adc_test_signal_gen]
create_bd_intf_pin -mode Slave -vlnv xilinx.com:interface:axis_rtl:1.0 s_axis_pts
create_bd_intf_pin -mode Master -vlnv xilinx.com:interface:axis_rtl:1.0 m_axis_testsig_pdti
create_bd_intf_pin -mode Slave -vlnv xilinx.com:interface:aximm_rtl:1.0 s_axi_csr
create_bd_intf_pin -mode Slave -vlnv xilinx.com:interface:axis_rtl:1.0 s_axis_ptctl
create_bd_pin -dir I s_axi_csr_aclk
create_bd_pin -dir I s_axi_csr_aresetn
create_bd_pin -dir I sample_clk_a
create_bd_pin -dir I aresetn
create_bd_pin -dir O testsig_irq

create_bd_cell -type ip -vlnv pentek.com:px_ip:px_axis_pdti_mrg:1.0 axis_pdti_mrg
set_property -dict [list \
  CONFIG.data_stream_delay 0 \
  CONFIG.info_stream_delay 0 \
  CONFIG.time_stream_delay 10 \
] [get_bd_cells axis_pdti_mrg]
create_bd_cell -type ip -vlnv pentek.com:px_ip:px_sig2pxaxis:1.1 info_tstsig
set_property -dict [list \
  CONFIG.has_pd_output false \
  CONFIG.has_pts_output false \
  CONFIG.use_info_inputs false \
  CONFIG.use_input_tvalid false \
  CONFIG.has_ptctl_output false \
] [get_bd_cells info_tstsig]
create_bd_cell -type ip -vlnv pentek.com:px_ip:px_test_sig_gen:1.0 test_sig_gen

# ---- hierarchy /sample_clk_gen ----
current_bd_instance /sample_clk_gen
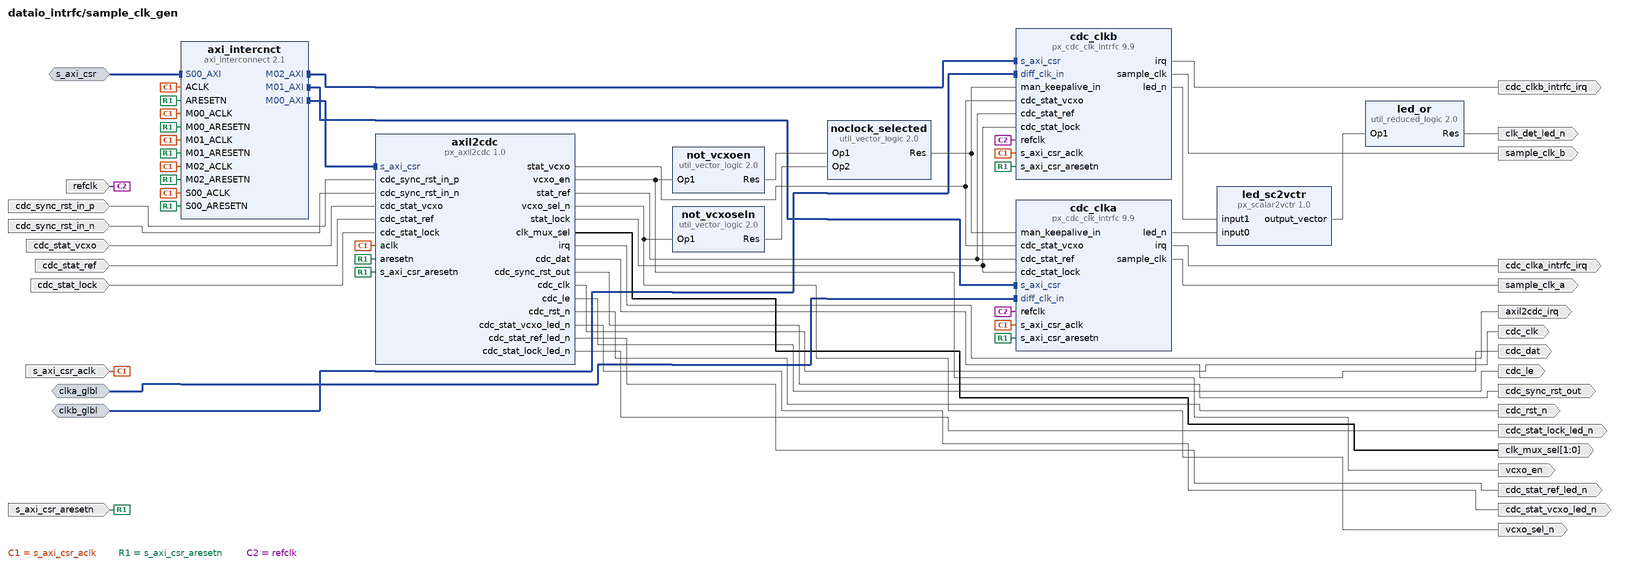
[diagram p11: block diagram inside /sample_clk_gen]
create_bd_intf_pin -mode Slave -vlnv xilinx.com:interface:diff_clock_rtl:1.0 clka_glbl
create_bd_intf_pin -mode Slave -vlnv xilinx.com:interface:diff_clock_rtl:1.0 clkb_glbl
create_bd_intf_pin -mode Slave -vlnv xilinx.com:interface:aximm_rtl:1.0 s_axi_csr
create_bd_pin -dir I s_axi_csr_aclk
create_bd_pin -dir I s_axi_csr_aresetn
create_bd_pin -dir O vcxo_en
create_bd_pin -dir O vcxo_sel_n
create_bd_pin -dir O -from 1 -to 0 clk_mux_sel
create_bd_pin -dir O cdc_sync_rst_out
create_bd_pin -dir O clk_det_led_n
create_bd_pin -dir O cdc_clka_intrfc_irq
create_bd_pin -dir O axil2cdc_irq
create_bd_pin -dir I cdc_sync_rst_in_p
create_bd_pin -dir I cdc_sync_rst_in_n
create_bd_pin -dir I refclk
create_bd_pin -dir O sample_clk_a
create_bd_pin -dir O cdc_clkb_intrfc_irq
create_bd_pin -dir O sample_clk_b
create_bd_pin -dir I cdc_stat_vcxo
create_bd_pin -dir I cdc_stat_ref
create_bd_pin -dir I cdc_stat_lock
create_bd_pin -dir O cdc_dat
create_bd_pin -dir O -type clk cdc_clk
create_bd_pin -dir O cdc_le
create_bd_pin -dir O -type rst cdc_rst_n
create_bd_pin -dir O cdc_stat_vcxo_led_n
create_bd_pin -dir O cdc_stat_ref_led_n
create_bd_pin -dir O cdc_stat_lock_led_n

create_bd_cell -type ip -vlnv xilinx.com:ip:util_reduced_logic:2.0 led_or
set_property -dict {CONFIG.C_SIZE 2 CONFIG.C_OPERATION or} [get_bd_cells led_or]
create_bd_cell -type ip -vlnv xilinx.com:ip:axi_interconnect:2.1 axi_intercnct
set_property -dict [list \
  CONFIG.NUM_MI 3 \
  CONFIG.M00_HAS_REGSLICE 3 \
  CONFIG.M01_HAS_REGSLICE 3 \
  CONFIG.M02_HAS_REGSLICE 3 \
  CONFIG.S00_HAS_REGSLICE 1 \
] [get_bd_cells axi_intercnct]
create_bd_cell -type ip -vlnv xilinx.com:ip:util_vector_logic:2.0 not_vcxoseln
set_property -dict {CONFIG.C_SIZE 1 CONFIG.C_OPERATION not} [get_bd_cells not_vcxoseln]
create_bd_cell -type ip -vlnv xilinx.com:ip:util_vector_logic:2.0 noclock_selected
set_property -dict {CONFIG.C_SIZE 1 CONFIG.C_OPERATION and} [get_bd_cells noclock_selected]
create_bd_cell -type ip -vlnv pentek.com:px_ip:px_axil2cdc:1.0 axil2cdc
set_property -dict [list \
  CONFIG.default_word0 0x00013000 \
  CONFIG.default_word1 0x0000007d \
  CONFIG.default_word2 0xd00000a2 \
  CONFIG.default_word3 0x00000027 \
] [get_bd_cells axil2cdc]
create_bd_cell -type ip -vlnv pentek.com:px_ip:px_scalar2vctr:1.0 led_sc2vctr
set_property -dict {CONFIG.number_inputs 2} [get_bd_cells led_sc2vctr]
create_bd_cell -type ip -vlnv xilinx.com:ip:util_vector_logic:2.0 not_vcxoen
set_property -dict {CONFIG.C_SIZE 1 CONFIG.C_OPERATION not} [get_bd_cells not_vcxoen]
create_bd_cell -type ip -vlnv pentek.com:px_ip:px_cdc_clk_intrfc:9.9 cdc_clka
set_property -dict {CONFIG.has_man_keepalive_in true} [get_bd_cells cdc_clka]
create_bd_cell -type ip -vlnv pentek.com:px_ip:px_cdc_clk_intrfc:9.9 cdc_clkb
set_property -dict {CONFIG.has_man_keepalive_in true} [get_bd_cells cdc_clkb]

# ---- hierarchy /interrupts ----
current_bd_instance /interrupts
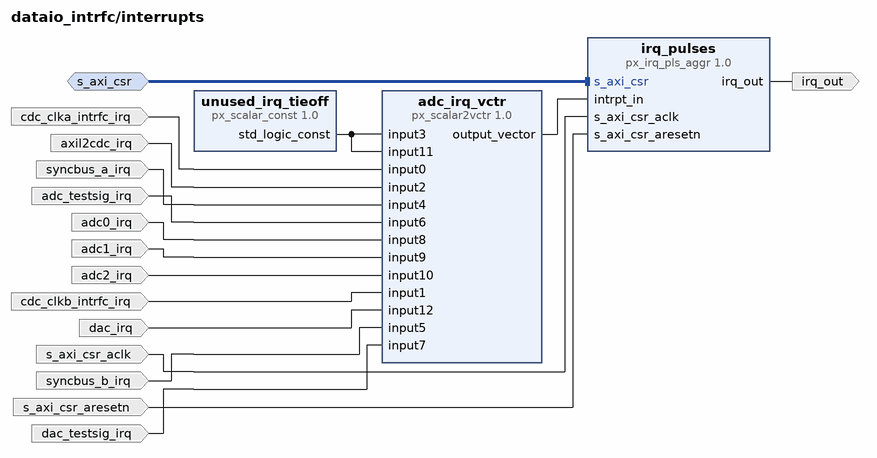
[diagram p12: block diagram inside /interrupts]
create_bd_intf_pin -mode Slave -vlnv xilinx.com:interface:aximm_rtl:1.0 s_axi_csr
create_bd_pin -dir O -type intr irq_out
create_bd_pin -dir I s_axi_csr_aclk
create_bd_pin -dir I s_axi_csr_aresetn
create_bd_pin -dir I cdc_clka_intrfc_irq
create_bd_pin -dir I axil2cdc_irq
create_bd_pin -dir I syncbus_a_irq
create_bd_pin -dir I adc_testsig_irq
create_bd_pin -dir I adc0_irq
create_bd_pin -dir I adc1_irq
create_bd_pin -dir I adc2_irq
create_bd_pin -dir I dac_irq
create_bd_pin -dir I cdc_clkb_intrfc_irq
create_bd_pin -dir I syncbus_b_irq
create_bd_pin -dir I dac_testsig_irq

create_bd_cell -type ip -vlnv pentek.com:px_ip:px_irq_pls_aggr:1.0 irq_pulses
set_property -dict {CONFIG.num_interrupt_sources 13} [get_bd_cells irq_pulses]
create_bd_cell -type ip -vlnv pentek.com:px_ip:px_scalar2vctr:1.0 adc_irq_vctr
set_property -dict {CONFIG.number_inputs 13} [get_bd_cells adc_irq_vctr]
create_bd_cell -type ip -vlnv pentek.com:px_ip:px_scalar_const:1.0 unused_irq_tieoff

# ---- hierarchy /dac_test_signal_gen ----
current_bd_instance /dac_test_signal_gen
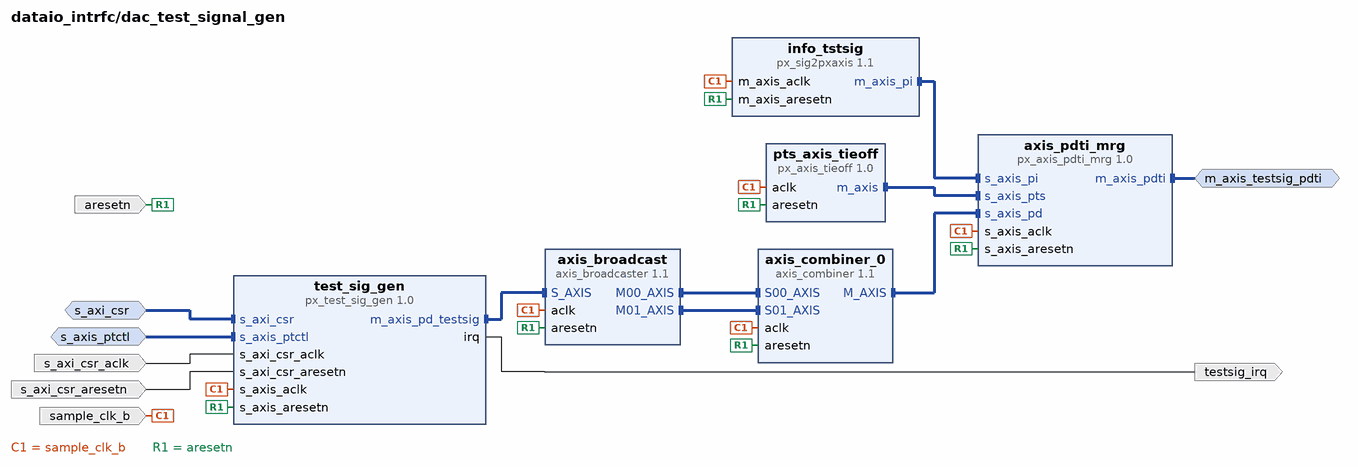
[diagram p13: block diagram inside /dac_test_signal_gen]
create_bd_intf_pin -mode Master -vlnv xilinx.com:interface:axis_rtl:1.0 m_axis_testsig_pdti
create_bd_intf_pin -mode Slave -vlnv xilinx.com:interface:aximm_rtl:1.0 s_axi_csr
create_bd_intf_pin -mode Slave -vlnv xilinx.com:interface:axis_rtl:1.0 s_axis_ptctl
create_bd_pin -dir I s_axi_csr_aclk
create_bd_pin -dir I s_axi_csr_aresetn
create_bd_pin -dir I sample_clk_b
create_bd_pin -dir I aresetn
create_bd_pin -dir O testsig_irq

create_bd_cell -type ip -vlnv xilinx.com:ip:axis_broadcaster:1.1 axis_broadcast
set_property -dict {CONFIG.M00_TDATA_REMAP {tdata[15:0]} CONFIG.M01_TDATA_REMAP {tdata[15:0]}} [get_bd_cells axis_broadcast]
create_bd_cell -type ip -vlnv xilinx.com:ip:axis_combiner:1.1 axis_combiner_0
create_bd_cell -type ip -vlnv pentek.com:px_ip:px_axis_pdti_mrg:1.0 axis_pdti_mrg
set_property -dict [list \
  CONFIG.data_byte_width 4 \
  CONFIG.data_stream_delay 0 \
  CONFIG.info_stream_delay 0 \
  CONFIG.time_stream_delay 0 \
] [get_bd_cells axis_pdti_mrg]
create_bd_cell -type ip -vlnv pentek.com:px_ip:px_sig2pxaxis:1.1 info_tstsig
set_property -dict [list \
  CONFIG.data_byte_width 4 \
  CONFIG.has_pd_output false \
  CONFIG.has_pts_output false \
  CONFIG.use_info_inputs false \
  CONFIG.use_input_tvalid false \
  CONFIG.dflt_data_format 3 \
  CONFIG.has_ptctl_output false \
] [get_bd_cells info_tstsig]
create_bd_cell -type ip -vlnv pentek.com:px_ip:px_axis_tieoff:1.0 pts_axis_tieoff
set_property -dict [list \
  CONFIG.num_data_bytes 8 \
  CONFIG.num_user_bits 24 \
  CONFIG.tvalid_asserted true \
  CONFIG.has_tready false \
] [get_bd_cells pts_axis_tieoff]
create_bd_cell -type ip -vlnv pentek.com:px_ip:px_test_sig_gen:1.0 test_sig_gen

# ---- connections ----

current_bd_instance /adc_inputs
connect_bd_intf_net [get_bd_intf_pins axi_interconnect_0/M00_AXI] [get_bd_intf_pins px_ads5485intrfc_0/s_axi_csr]
connect_bd_intf_net [get_bd_intf_pins axi_interconnect_0/M01_AXI] [get_bd_intf_pins px_ads5485intrfc_1/s_axi_csr]
connect_bd_intf_net [get_bd_intf_pins axi_interconnect_0/M02_AXI] [get_bd_intf_pins px_ads5485intrfc_2/s_axi_csr]
connect_bd_intf_net [get_bd_intf_pins s_axi_csr] [get_bd_intf_pins axi_interconnect_0/S00_AXI]
connect_bd_intf_net [get_bd_intf_pins m_axis_adc0_pd_dataio] [get_bd_intf_pins px_ads5485intrfc_0/m_axis_dataio]
connect_bd_intf_net [get_bd_intf_pins m_axis_adc1_pd_dataio] [get_bd_intf_pins px_ads5485intrfc_1/m_axis_dataio]
connect_bd_intf_net [get_bd_intf_pins m_axis_adc2_pd_dataio] [get_bd_intf_pins px_ads5485intrfc_2/m_axis_dataio]
connect_bd_net -net s_axi_aclk_1 [get_bd_pins s_axi_csr_aclk] \
  [get_bd_pins px_ads5485intrfc_0/s_axi_csr_aclk] [get_bd_pins px_ads5485intrfc_1/s_axi_csr_aclk] \
  [get_bd_pins px_ads5485intrfc_2/s_axi_csr_aclk] [get_bd_pins axi_interconnect_0/ACLK] \
  [get_bd_pins axi_interconnect_0/S00_ACLK] [get_bd_pins axi_interconnect_0/M00_ACLK] \
  [get_bd_pins axi_interconnect_0/M01_ACLK] [get_bd_pins axi_interconnect_0/M02_ACLK] \
  [get_bd_pins axi_interconnect_0/M03_ACLK]
connect_bd_net -net s_axi_aresetn_1 [get_bd_pins s_axi_csr_aresetn] \
  [get_bd_pins px_ads5485intrfc_0/s_axi_csr_aresetn] [get_bd_pins px_ads5485intrfc_1/s_axi_csr_aresetn] \
  [get_bd_pins px_ads5485intrfc_2/s_axi_csr_aresetn] [get_bd_pins axi_interconnect_0/ARESETN] \
  [get_bd_pins axi_interconnect_0/S00_ARESETN] [get_bd_pins axi_interconnect_0/M00_ARESETN] \
  [get_bd_pins axi_interconnect_0/M01_ARESETN] [get_bd_pins axi_interconnect_0/M02_ARESETN] \
  [get_bd_pins axi_interconnect_0/M03_ARESETN]
connect_bd_net [get_bd_pins adc0_d0_1_p] [get_bd_pins px_ads5485intrfc_0/d0_1_p]
connect_bd_net [get_bd_pins adc0_d0_1_n] [get_bd_pins px_ads5485intrfc_0/d0_1_n]
connect_bd_net [get_bd_pins adc0_d2_3_p] [get_bd_pins px_ads5485intrfc_0/d2_3_p]
connect_bd_net [get_bd_pins adc0_d2_3_n] [get_bd_pins px_ads5485intrfc_0/d2_3_n]
connect_bd_net [get_bd_pins adc0_d4_5_p] [get_bd_pins px_ads5485intrfc_0/d4_5_p]
connect_bd_net [get_bd_pins adc0_d4_5_n] [get_bd_pins px_ads5485intrfc_0/d4_5_n]
connect_bd_net [get_bd_pins adc0_d6_7_p] [get_bd_pins px_ads5485intrfc_0/d6_7_p]
connect_bd_net [get_bd_pins adc0_d6_7_n] [get_bd_pins px_ads5485intrfc_0/d6_7_n]
connect_bd_net [get_bd_pins adc0_d8_9_p] [get_bd_pins px_ads5485intrfc_0/d8_9_p]
connect_bd_net [get_bd_pins adc0_d8_9_n] [get_bd_pins px_ads5485intrfc_0/d8_9_n]
connect_bd_net [get_bd_pins adc0_d10_11_p] [get_bd_pins px_ads5485intrfc_0/d10_11_p]
connect_bd_net [get_bd_pins adc0_d10_11_n] [get_bd_pins px_ads5485intrfc_0/d10_11_n]
connect_bd_net [get_bd_pins adc0_d12_13_p] [get_bd_pins px_ads5485intrfc_0/d12_13_p]
connect_bd_net [get_bd_pins adc0_d12_13_n] [get_bd_pins px_ads5485intrfc_0/d12_13_n]
connect_bd_net [get_bd_pins adc0_d14_15_p] [get_bd_pins px_ads5485intrfc_0/d14_15_p]
connect_bd_net [get_bd_pins adc0_d14_15_n] [get_bd_pins px_ads5485intrfc_0/d14_15_n]
connect_bd_net [get_bd_pins sample_clk_a] \
  [get_bd_pins px_ads5485intrfc_0/sample_clk] [get_bd_pins px_ads5485intrfc_1/sample_clk] \
  [get_bd_pins px_ads5485intrfc_2/sample_clk]
connect_bd_net [get_bd_pins adc1_d0_1_p] [get_bd_pins px_ads5485intrfc_1/d0_1_p]
connect_bd_net [get_bd_pins adc1_d0_1_n] [get_bd_pins px_ads5485intrfc_1/d0_1_n]
connect_bd_net [get_bd_pins adc1_d2_3_p] [get_bd_pins px_ads5485intrfc_1/d2_3_p]
connect_bd_net [get_bd_pins adc1_d2_3_n] [get_bd_pins px_ads5485intrfc_1/d2_3_n]
connect_bd_net [get_bd_pins adc1_d6_7_p] [get_bd_pins px_ads5485intrfc_1/d6_7_p]
connect_bd_net [get_bd_pins adc1_d6_7_n] [get_bd_pins px_ads5485intrfc_1/d6_7_n]
connect_bd_net [get_bd_pins adc1_d8_9_p] [get_bd_pins px_ads5485intrfc_1/d8_9_p]
connect_bd_net [get_bd_pins adc1_d8_9_n] [get_bd_pins px_ads5485intrfc_1/d8_9_n]
connect_bd_net [get_bd_pins adc1_d10_11_p] [get_bd_pins px_ads5485intrfc_1/d10_11_p]
connect_bd_net [get_bd_pins adc1_d10_11_n] [get_bd_pins px_ads5485intrfc_1/d10_11_n]
connect_bd_net [get_bd_pins adc1_d12_13_p] [get_bd_pins px_ads5485intrfc_1/d12_13_p]
connect_bd_net [get_bd_pins adc1_d12_13_n] [get_bd_pins px_ads5485intrfc_1/d12_13_n]
connect_bd_net [get_bd_pins adc1_d14_15_p] [get_bd_pins px_ads5485intrfc_1/d14_15_p]
connect_bd_net [get_bd_pins adc1_d14_15_n] [get_bd_pins px_ads5485intrfc_1/d14_15_n]
connect_bd_net [get_bd_pins adc2_d0_1_p] [get_bd_pins px_ads5485intrfc_2/d0_1_p]
connect_bd_net [get_bd_pins adc2_d2_3_n] [get_bd_pins px_ads5485intrfc_2/d0_1_n]
connect_bd_net [get_bd_pins adc2_d2_3_p] [get_bd_pins px_ads5485intrfc_2/d2_3_p]
connect_bd_net [get_bd_pins adc2_d0_1_n] [get_bd_pins px_ads5485intrfc_2/d2_3_n]
connect_bd_net [get_bd_pins adc2_d4_5_p] [get_bd_pins px_ads5485intrfc_2/d4_5_p]
connect_bd_net [get_bd_pins adc2_d4_5_n] [get_bd_pins px_ads5485intrfc_2/d4_5_n]
connect_bd_net [get_bd_pins adc2_d6_7_n] [get_bd_pins px_ads5485intrfc_2/d6_7_n]
connect_bd_net [get_bd_pins adc2_d6_7_p] [get_bd_pins px_ads5485intrfc_2/d6_7_p]
connect_bd_net [get_bd_pins adc2_d8_9_n] [get_bd_pins px_ads5485intrfc_2/d8_9_n]
connect_bd_net [get_bd_pins adc2_d8_9_p] [get_bd_pins px_ads5485intrfc_2/d8_9_p]
connect_bd_net [get_bd_pins adc2_d10_11_n] [get_bd_pins px_ads5485intrfc_2/d10_11_n]
connect_bd_net [get_bd_pins adc2_d10_11_p] [get_bd_pins px_ads5485intrfc_2/d10_11_p]
connect_bd_net [get_bd_pins adc2_d12_13_n] [get_bd_pins px_ads5485intrfc_2/d12_13_n]
connect_bd_net [get_bd_pins adc2_d12_13_p] [get_bd_pins px_ads5485intrfc_2/d12_13_p]
connect_bd_net [get_bd_pins adc2_d14_15_n] [get_bd_pins px_ads5485intrfc_2/d14_15_n]
connect_bd_net [get_bd_pins adc2_d14_15_p] [get_bd_pins px_ads5485intrfc_2/d14_15_p]
connect_bd_net [get_bd_pins adc0_fifo_full_stat] [get_bd_pins px_ads5485intrfc_0/ext_led_src]
connect_bd_net -net adc1_fifo_full_stat1_1 [get_bd_pins adc1_fifo_full_stat] [get_bd_pins px_ads5485intrfc_1/ext_led_src]
connect_bd_net [get_bd_pins adc2_fifo_full_stat] [get_bd_pins px_ads5485intrfc_2/ext_led_src]
connect_bd_net [get_bd_pins px_ads5485intrfc_0/irq] [get_bd_pins adc0_irq]
connect_bd_net [get_bd_pins px_ads5485intrfc_0/pdwnf] [get_bd_pins adc0_pdwnf]
connect_bd_net [get_bd_pins px_ads5485intrfc_0/dither] [get_bd_pins adc_dither]
connect_bd_net [get_bd_pins px_ads5485intrfc_0/ovld_led_n] [get_bd_pins adc0_ovld_led_n]
connect_bd_net [get_bd_pins px_ads5485intrfc_1/ovld_led_n] [get_bd_pins adc1_ovld_led_n]
connect_bd_net [get_bd_pins px_ads5485intrfc_2/ovld_led_n] [get_bd_pins adc2_ovld_led_n]
connect_bd_net [get_bd_pins px_ads5485intrfc_0/adc_ovrld] [get_bd_pins adc0_ovrld]
connect_bd_net [get_bd_pins px_ads5485intrfc_1/adc_ovrld] [get_bd_pins adc1_ovrld]
connect_bd_net [get_bd_pins px_ads5485intrfc_2/adc_ovrld] [get_bd_pins adc2_ovrld]
connect_bd_net [get_bd_pins px_ads5485intrfc_0/go_trim_ovrld] [get_bd_pins adc0_go_trim_ovrld]
connect_bd_net [get_bd_pins px_ads5485intrfc_1/go_trim_ovrld] [get_bd_pins adc1_go_trim_ovrld]
connect_bd_net [get_bd_pins px_ads5485intrfc_2/go_trim_ovrld] [get_bd_pins adc2_go_trim_ovrld]
connect_bd_net [get_bd_pins px_ads5485intrfc_1/irq] [get_bd_pins adc1_irq]
connect_bd_net [get_bd_pins px_ads5485intrfc_2/irq] [get_bd_pins adc2_irq]
connect_bd_net [get_bd_pins px_ads5485intrfc_1/pdwnf] [get_bd_pins adc1_pdwnf]
connect_bd_net [get_bd_pins px_ads5485intrfc_2/pdwnf] [get_bd_pins adc2_pdwnf]
connect_bd_net [get_bd_pins adc1_d4_5_p] [get_bd_pins px_ads5485intrfc_1/d4_5_p]
connect_bd_net [get_bd_pins adc1_d4_5_n] [get_bd_pins px_ads5485intrfc_1/d4_5_n]

current_bd_instance /merge_streams
connect_bd_intf_net [get_bd_intf_pins info_adc0/m_axis_pi] [get_bd_intf_pins adc0_pdti_mrg/s_axis_pi]
connect_bd_intf_net [get_bd_intf_pins info_adc1/m_axis_pi] [get_bd_intf_pins adc1_pdti_mrg/s_axis_pi]
connect_bd_intf_net [get_bd_intf_pins adc2_pdti_mrg/s_axis_pi] [get_bd_intf_pins info_adc2/m_axis_pi]
connect_bd_intf_net [get_bd_intf_pins adc0_pdti_mrg/s_axis_pts] [get_bd_intf_pins axis_pts_broadcast/M00_AXIS]
connect_bd_intf_net [get_bd_intf_pins adc1_pdti_mrg/s_axis_pts] [get_bd_intf_pins axis_pts_broadcast/M01_AXIS]
connect_bd_intf_net [get_bd_intf_pins adc2_pdti_mrg/s_axis_pts] [get_bd_intf_pins axis_pts_broadcast/M02_AXIS]
connect_bd_intf_net [get_bd_intf_pins s_axis_pts] [get_bd_intf_pins axis_pts_broadcast/S_AXIS]
connect_bd_intf_net [get_bd_intf_pins m_axis_adc0_pdti] [get_bd_intf_pins adc0_pdti_mrg/m_axis_pdti]
connect_bd_intf_net [get_bd_intf_pins m_axis_adc1_pdti] [get_bd_intf_pins adc1_pdti_mrg/m_axis_pdti]
connect_bd_intf_net [get_bd_intf_pins m_axis_adc2_pdti] [get_bd_intf_pins adc2_pdti_mrg/m_axis_pdti]
connect_bd_intf_net [get_bd_intf_pins s_axis_adc0_pd_dataio] [get_bd_intf_pins adc0_pdti_mrg/s_axis_pd]
connect_bd_intf_net [get_bd_intf_pins s_axis_adc1_pd_dataio] [get_bd_intf_pins adc1_pdti_mrg/s_axis_pd]
connect_bd_intf_net [get_bd_intf_pins s_axis_adc2_pd_dataio] [get_bd_intf_pins adc2_pdti_mrg/s_axis_pd]
connect_bd_net [get_bd_pins sample_clk_a] \
  [get_bd_pins axis_pts_broadcast/aclk] [get_bd_pins adc0_pdti_mrg/s_axis_aclk] [get_bd_pins adc1_pdti_mrg/s_axis_aclk] \
  [get_bd_pins adc2_pdti_mrg/s_axis_aclk] [get_bd_pins info_adc0/m_axis_aclk] [get_bd_pins info_adc1/m_axis_aclk] \
  [get_bd_pins info_adc2/m_axis_aclk]
connect_bd_net [get_bd_pins aresetn] \
  [get_bd_pins axis_pts_broadcast/aresetn] [get_bd_pins adc0_pdti_mrg/s_axis_aresetn] \
  [get_bd_pins adc1_pdti_mrg/s_axis_aresetn] [get_bd_pins adc2_pdti_mrg/s_axis_aresetn] \
  [get_bd_pins info_adc0/m_axis_aresetn] [get_bd_pins info_adc1/m_axis_aresetn] [get_bd_pins info_adc2/m_axis_aresetn]

current_bd_instance /stream_mux
connect_bd_intf_net [get_bd_intf_pins adc0_broadcast/M00_AXIS] [get_bd_intf_pins chan0_mux/s_axis_i0_pdti]
connect_bd_intf_net [get_bd_intf_pins adc1_broadcast/M00_AXIS] [get_bd_intf_pins chan0_mux/s_axis_i1_pdti]
connect_bd_intf_net [get_bd_intf_pins adc2_broadcast/M00_AXIS] [get_bd_intf_pins chan0_mux/s_axis_i2_pdti]
connect_bd_intf_net [get_bd_intf_pins adc0_broadcast/M01_AXIS] [get_bd_intf_pins chan1_mux/s_axis_i0_pdti]
connect_bd_intf_net [get_bd_intf_pins adc1_broadcast/M01_AXIS] [get_bd_intf_pins chan1_mux/s_axis_i1_pdti]
connect_bd_intf_net [get_bd_intf_pins adc2_broadcast/M01_AXIS] [get_bd_intf_pins chan1_mux/s_axis_i2_pdti]
connect_bd_intf_net [get_bd_intf_pins testsig_broadcast/M01_AXIS] [get_bd_intf_pins chan1_mux/s_axis_i4_pdti]
connect_bd_intf_net [get_bd_intf_pins adc0_broadcast/M02_AXIS] [get_bd_intf_pins chan2_mux/s_axis_i0_pdti]
connect_bd_intf_net [get_bd_intf_pins adc1_broadcast/M02_AXIS] [get_bd_intf_pins chan2_mux/s_axis_i1_pdti]
connect_bd_intf_net [get_bd_intf_pins adc2_broadcast/M02_AXIS] [get_bd_intf_pins chan2_mux/s_axis_i2_pdti]
connect_bd_intf_net [get_bd_intf_pins testsig_broadcast/M02_AXIS] [get_bd_intf_pins chan2_mux/s_axis_i4_pdti]
connect_bd_intf_net [get_bd_intf_pins axi_interconnect_0/M00_AXI] [get_bd_intf_pins chan0_mux/s_axi_csr]
connect_bd_intf_net [get_bd_intf_pins axi_interconnect_0/M01_AXI] [get_bd_intf_pins chan1_mux/s_axi_csr]
connect_bd_intf_net [get_bd_intf_pins axi_interconnect_0/M02_AXI] [get_bd_intf_pins chan2_mux/s_axi_csr]
connect_bd_intf_net [get_bd_intf_pins testsig_broadcast/M00_AXIS] [get_bd_intf_pins chan0_mux/s_axis_i4_pdti]
connect_bd_intf_net [get_bd_intf_pins testsig_broadcast/M03_AXIS] [get_bd_intf_pins chan0_mux/s_axis_i3_pdti]
connect_bd_intf_net [get_bd_intf_pins testsig_broadcast/M04_AXIS] [get_bd_intf_pins chan1_mux/s_axis_i3_pdti]
connect_bd_intf_net [get_bd_intf_pins testsig_broadcast/M05_AXIS] [get_bd_intf_pins chan2_mux/s_axis_i3_pdti]
connect_bd_intf_net [get_bd_intf_pins s_axi_csr] [get_bd_intf_pins axi_interconnect_0/S00_AXI]
connect_bd_intf_net [get_bd_intf_pins s_axis_adc0_pdti] [get_bd_intf_pins adc0_broadcast/S_AXIS]
connect_bd_intf_net [get_bd_intf_pins s_axis_adc1_pdti] [get_bd_intf_pins adc1_broadcast/S_AXIS]
connect_bd_intf_net [get_bd_intf_pins s_axis_adc2_pdti] [get_bd_intf_pins adc2_broadcast/S_AXIS]
connect_bd_intf_net [get_bd_intf_pins s_axis_testsig_pdti] [get_bd_intf_pins testsig_broadcast/S_AXIS]
connect_bd_intf_net [get_bd_intf_pins m_axis_ch0_pdti] [get_bd_intf_pins chan0_mux/m_axis_pdti]
connect_bd_intf_net [get_bd_intf_pins m_axis_ch1_pdti] [get_bd_intf_pins chan1_mux/m_axis_pdti]
connect_bd_intf_net [get_bd_intf_pins m_axis_ch2_pdti] [get_bd_intf_pins chan2_mux/m_axis_pdti]
connect_bd_net [get_bd_pins s_axi_csr_aclk] \
  [get_bd_pins chan1_mux/s_axi_csr_aclk] [get_bd_pins chan2_mux/s_axi_csr_aclk] [get_bd_pins chan0_mux/s_axi_csr_aclk] \
  [get_bd_pins axi_interconnect_0/ACLK] [get_bd_pins axi_interconnect_0/S00_ACLK] [get_bd_pins axi_interconnect_0/M00_ACLK] \
  [get_bd_pins axi_interconnect_0/M01_ACLK] [get_bd_pins axi_interconnect_0/M02_ACLK]
connect_bd_net [get_bd_pins s_axi_csr_aresetn] \
  [get_bd_pins chan1_mux/s_axi_csr_aresetn] [get_bd_pins chan2_mux/s_axi_csr_aresetn] \
  [get_bd_pins chan0_mux/s_axi_csr_aresetn] [get_bd_pins axi_interconnect_0/ARESETN] \
  [get_bd_pins axi_interconnect_0/S00_ARESETN] [get_bd_pins axi_interconnect_0/M00_ARESETN] \
  [get_bd_pins axi_interconnect_0/M01_ARESETN] [get_bd_pins axi_interconnect_0/M02_ARESETN]
connect_bd_net [get_bd_pins sample_clk_a] \
  [get_bd_pins adc0_broadcast/aclk] [get_bd_pins adc1_broadcast/aclk] [get_bd_pins adc2_broadcast/aclk] \
  [get_bd_pins testsig_broadcast/aclk] [get_bd_pins chan1_mux/s_axis_aclk] [get_bd_pins chan2_mux/s_axis_aclk] \
  [get_bd_pins chan0_mux/s_axis_aclk]
connect_bd_net [get_bd_pins aresetn] \
  [get_bd_pins adc0_broadcast/aresetn] [get_bd_pins adc1_broadcast/aresetn] [get_bd_pins adc2_broadcast/aresetn] \
  [get_bd_pins testsig_broadcast/aresetn] [get_bd_pins chan1_mux/s_axis_aresetn] [get_bd_pins chan2_mux/s_axis_aresetn] \
  [get_bd_pins chan0_mux/s_axis_aresetn]
